# EAGLE schematic PWM_Board_77X (EAGLE 7.7.0)

## Sheet 1 of 7
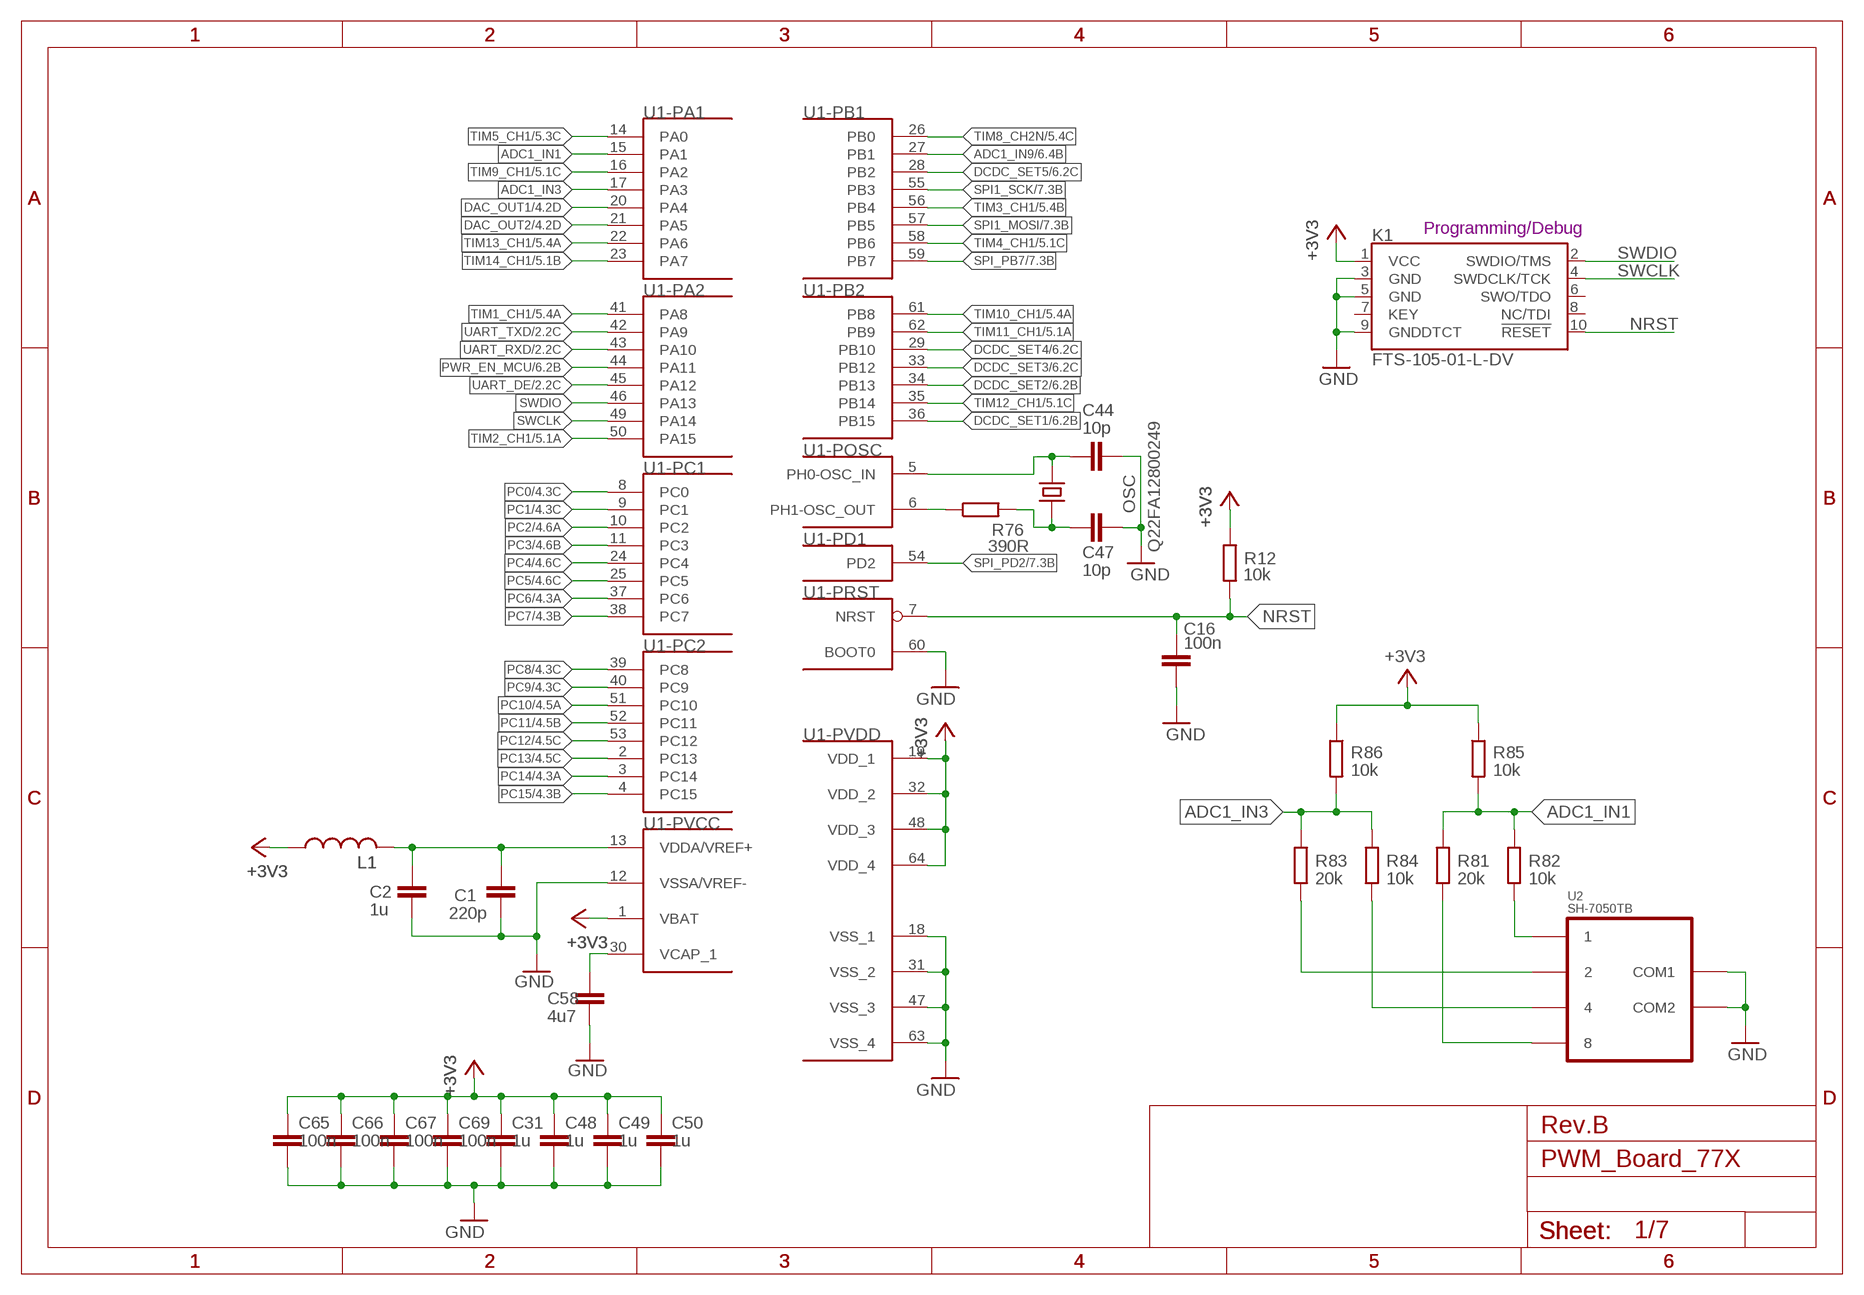
[diagram p0: schematic, sheet 1]

### Parts
C1  220p  C-EUC0603  [C0603]
C2  1u  C-EUC0805  [C0805]
C16  100n  C-EUC0603  [C0603]
C31  1u  C-EUC0805  [C0805]
C44  10p  C-EUC0603  [C0603]
C47  10p  C-EUC0603  [C0603]
C48  1u  C-EUC0805  [C0805]
C49  1u  C-EUC0805  [C0805]
C50  1u  C-EUC0805  [C0805]
C58  4u7  C-EUC0805  [C0805]
C65  100n  C-EUC0805  [C0805]
C66  100n  C-EUC0805  [C0805]
C67  100n  C-EUC0805  [C0805]
C69  100n  C-EUC0805  [C0805]
K1  FTS-105-01-L-DV  CORTEX_DEBUG_SMD  [SAMTECH_FTSH-105-01]
L1  L-US  [R1206]
OSC  Q22FA12800249  [OSCILATOR]
R12  10k  R-EU_R0603  [R0603]
R76  390R  R-EU_R0603  [R0603]
R81  20k  R-EU_R0603  [R0603]
R82  10k  R-EU_R0603  [R0603]
R83  20k  R-EU_R0603  [R0603]
R84  10k  R-EU_R0603  [R0603]
R85  10k  R-EU_R0603  [R0603]
R86  10k  R-EU_R0603  [R0603]
U1  STM32F446RE_64PIN  [LQFP64_F446RE]
U2  SH-7050TB  [HEX_DEC]

### Nets
+3V3: C31.1 C48.1 C49.1 C50.1 C65.1 C66.1 C67.1 C69.1 K1.1(VCC) L1.1 R12.2 R85.1 R86.1 U1.1(-PVCC:VBAT) U1.19(-PVDD:VDD_1) U1.32(-PVDD:VDD_2) U1.48(-PVDD:VDD_3) U1.64(-PVDD:VDD_4) ; also sheet 2,3
ADC1_IN1: R81.1 R82.1 R85.2 U1.15(-PA1:PA1)
ADC1_IN3: R83.1 R84.1 R86.2 U1.17(-PA1:PA3)
ADC1_IN9: U1.27(-PB1:PB1) ; also sheet 6
DAC_OUT1: U1.20(-PA1:PA4) ; also sheet 4
DAC_OUT2: U1.21(-PA1:PA5) ; also sheet 4
DCDC_SET1: U1.36(-PB2:PB15) ; also sheet 6
DCDC_SET2: U1.34(-PB2:PB13) ; also sheet 6
DCDC_SET3: U1.33(-PB2:PB12) ; also sheet 6
DCDC_SET4: U1.29(-PB2:PB10) ; also sheet 6
DCDC_SET5: U1.28(-PB1:PB2) ; also sheet 6
GND: C1.2 C2.2 C16.2 C31.2 C44.1 C47.1 C48.2 C49.2 C50.2 C58.2 C65.2 C66.2 C67.2 C69.2 K1.3(GND) K1.5(GND) K1.9(GNDDTCT) U1.12(-PVCC:VSSA/VREF-) U1.18(-PVDD:VSS_1) U1.31(-PVDD:VSS_2) U1.47(-PVDD:VSS_3) U1.60(-PRST:BOOT0) U1.63(-PVDD:VSS_4) U2.C1(COM1) U2.C2(COM2) ; also sheet 2,3,4,5,6,7
N$44: R81.2 U2.8
N$48: R83.2 U2.2
N$70: C58.1 U1.30(-PVCC:VCAP_1)
N$85: R84.2 U2.4
N$116: R82.2 U2.1
NRST: C16.1 K1.10(!RESET) R12.1 U1.7(-PRST:NRST)
OSC: C47.2 OSC.3 R76.2
OSC_IN: C44.2 OSC.1 U1.5(-POSC:PH0-OSC_IN)
OSC_OUT: R76.1 U1.6(-POSC:PH1-OSC_OUT)
PC0: U1.8(-PC1:PC0) ; also sheet 4
PC1: U1.9(-PC1:PC1) ; also sheet 4
PC2: U1.10(-PC1:PC2) ; also sheet 4
PC3: U1.11(-PC1:PC3) ; also sheet 4
PC4: U1.24(-PC1:PC4) ; also sheet 4
PC5: U1.25(-PC1:PC5) ; also sheet 4
PC6: U1.37(-PC1:PC6) ; also sheet 4
PC7: U1.38(-PC1:PC7) ; also sheet 4
PC8: U1.39(-PC2:PC8) ; also sheet 4
PC9: U1.40(-PC2:PC9) ; also sheet 4
PC10: U1.51(-PC2:PC10) ; also sheet 4
PC11: U1.52(-PC2:PC11) ; also sheet 4
PC12: U1.53(-PC2:PC12) ; also sheet 4
PC13: U1.2(-PC2:PC13) ; also sheet 4
PC14: U1.3(-PC2:PC14) ; also sheet 4
PC15: U1.4(-PC2:PC15) ; also sheet 4
PWR_EN_MCU: U1.44(-PA2:PA11) ; also sheet 6
SPI1_MOSI: U1.57(-PB1:PB5) ; also sheet 7
SPI1_SCK: U1.55(-PB1:PB3) ; also sheet 7
SPI_PB7: U1.59(-PB1:PB7) ; also sheet 7
SPI_PD2: U1.54(-PD1:PD2) ; also sheet 7
SWCLK: K1.4(SWDCLK/TCK) U1.49(-PA2:PA14)
SWDIO: K1.2(SWDIO/TMS) U1.46(-PA2:PA13)
TIM1_CH1: U1.41(-PA2:PA8) ; also sheet 5
TIM2_CH1: U1.50(-PA2:PA15) ; also sheet 5
TIM3_CH1: U1.56(-PB1:PB4) ; also sheet 5
TIM4_CH1: U1.58(-PB1:PB6) ; also sheet 5
TIM5_CH1: U1.14(-PA1:PA0) ; also sheet 5
TIM8_CH2N: U1.26(-PB1:PB0) ; also sheet 5
TIM9_CH1: U1.16(-PA1:PA2) ; also sheet 5
TIM10_CH1: U1.61(-PB2:PB8) ; also sheet 5
TIM11_CH1: U1.62(-PB2:PB9) ; also sheet 5
TIM12_CH1: U1.35(-PB2:PB14) ; also sheet 5
TIM13_CH1: U1.22(-PA1:PA6) ; also sheet 5
TIM14_CH1: U1.23(-PA1:PA7) ; also sheet 5
UART_DE: U1.45(-PA2:PA12) ; also sheet 2
UART_RXD: U1.43(-PA2:PA10) ; also sheet 2
UART_TXD: U1.42(-PA2:PA9) ; also sheet 2
VREF+: C1.1 C2.1 L1.2 U1.13(-PVCC:VDDA/VREF+)
Unconnected: K1.6(SWO/TDO) K1.7(KEY) K1.8(NC/TDI)

### Notes on the sheet
- Programming/Debug
- Rev.B

## Sheet 2 of 7
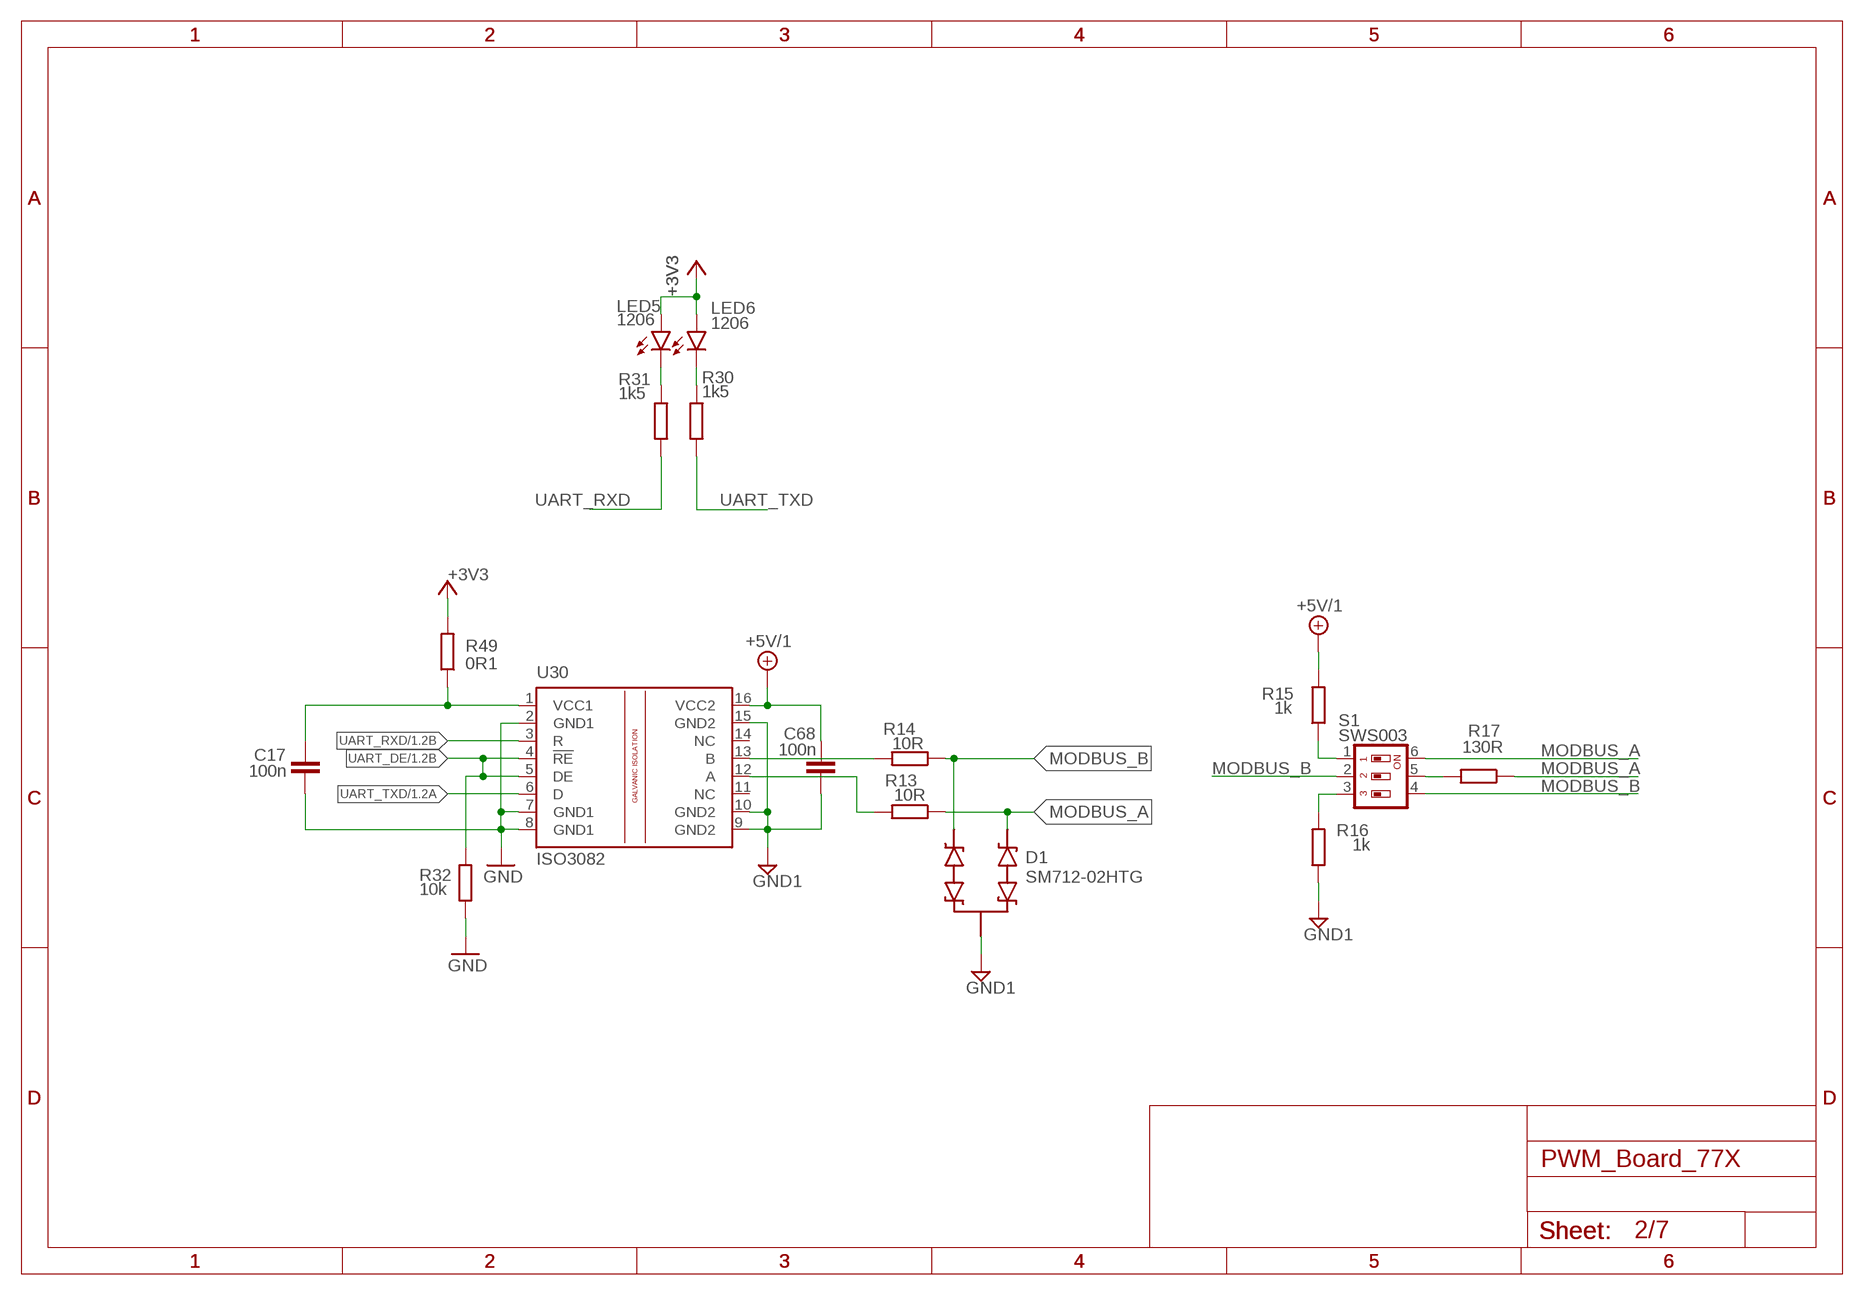
[diagram p1: schematic, sheet 2]

### Parts
C17  100n  C-EUC0805  [C0805]
C68  100n  C-EUC0805  [C0805]
D1  SM712-02HTG  [SOT23-BEC]
LED5  1206  LEDCHIPLED_1206  [CHIPLED_1206]
LED6  1206  LEDCHIPLED_1206  [CHIPLED_1206]
R13  10R  R-EU_R0603  [R0603]
R14  10R  R-EU_R0603  [R0603]
R15  1k  R-EU_R0603  [R0603]
R16  1k  R-EU_R0603  [R0603]
R17  130R  R-EU_R1206  [R1206]
R30  1k5  R-EU_R1206  [R1206]
R31  1k5  R-EU_R1206  [R1206]
R32  10k  R-EU_R0603  [R0603]
R49  0R1  R-EU_R1206  [R1206]
S1  SWS003  [SMS-003]
U30  ISO3082  [SO-16DW]

### Nets
+3V3: LED5.A LED6.A R49.2 ; also sheet 1,3
+5V/1: C68.1 R15.2 U30.16(VCC2) ; also sheet 3
GND: C17.2 R32.1 U30.2(GND1) U30.7(GND1) U30.8(GND1) ; also sheet 1,3,4,5,6,7
GND1: C68.2 D1.C(E) R16.1 U30.9(GND2) U30.10(GND2) U30.15(GND2) ; also sheet 3
MODBUS_A: D1.E R13.1 R17.1 S1.6 ; also sheet 3
MODBUS_B: D1.B R14.1 S1.2 S1.4 ; also sheet 3
N$7: R14.2 U30.13(B)
N$20: LED5.C R31.1
N$23: R13.2 U30.12(A)
N$34: R15.1 S1.1
N$35: R16.2 S1.3
N$36: R17.2 S1.5
N$37: LED6.C R30.1
N$67: C17.1 R49.1 U30.1(VCC1)
UART_DE: R32.2 U30.4(!RE) U30.5(DE) ; also sheet 1
UART_RXD: R31.2 U30.3(R) ; also sheet 1
UART_TXD: R30.2 U30.6(D) ; also sheet 1
Unconnected: U30.11(NC) U30.14(NC)

## Sheet 3 of 7
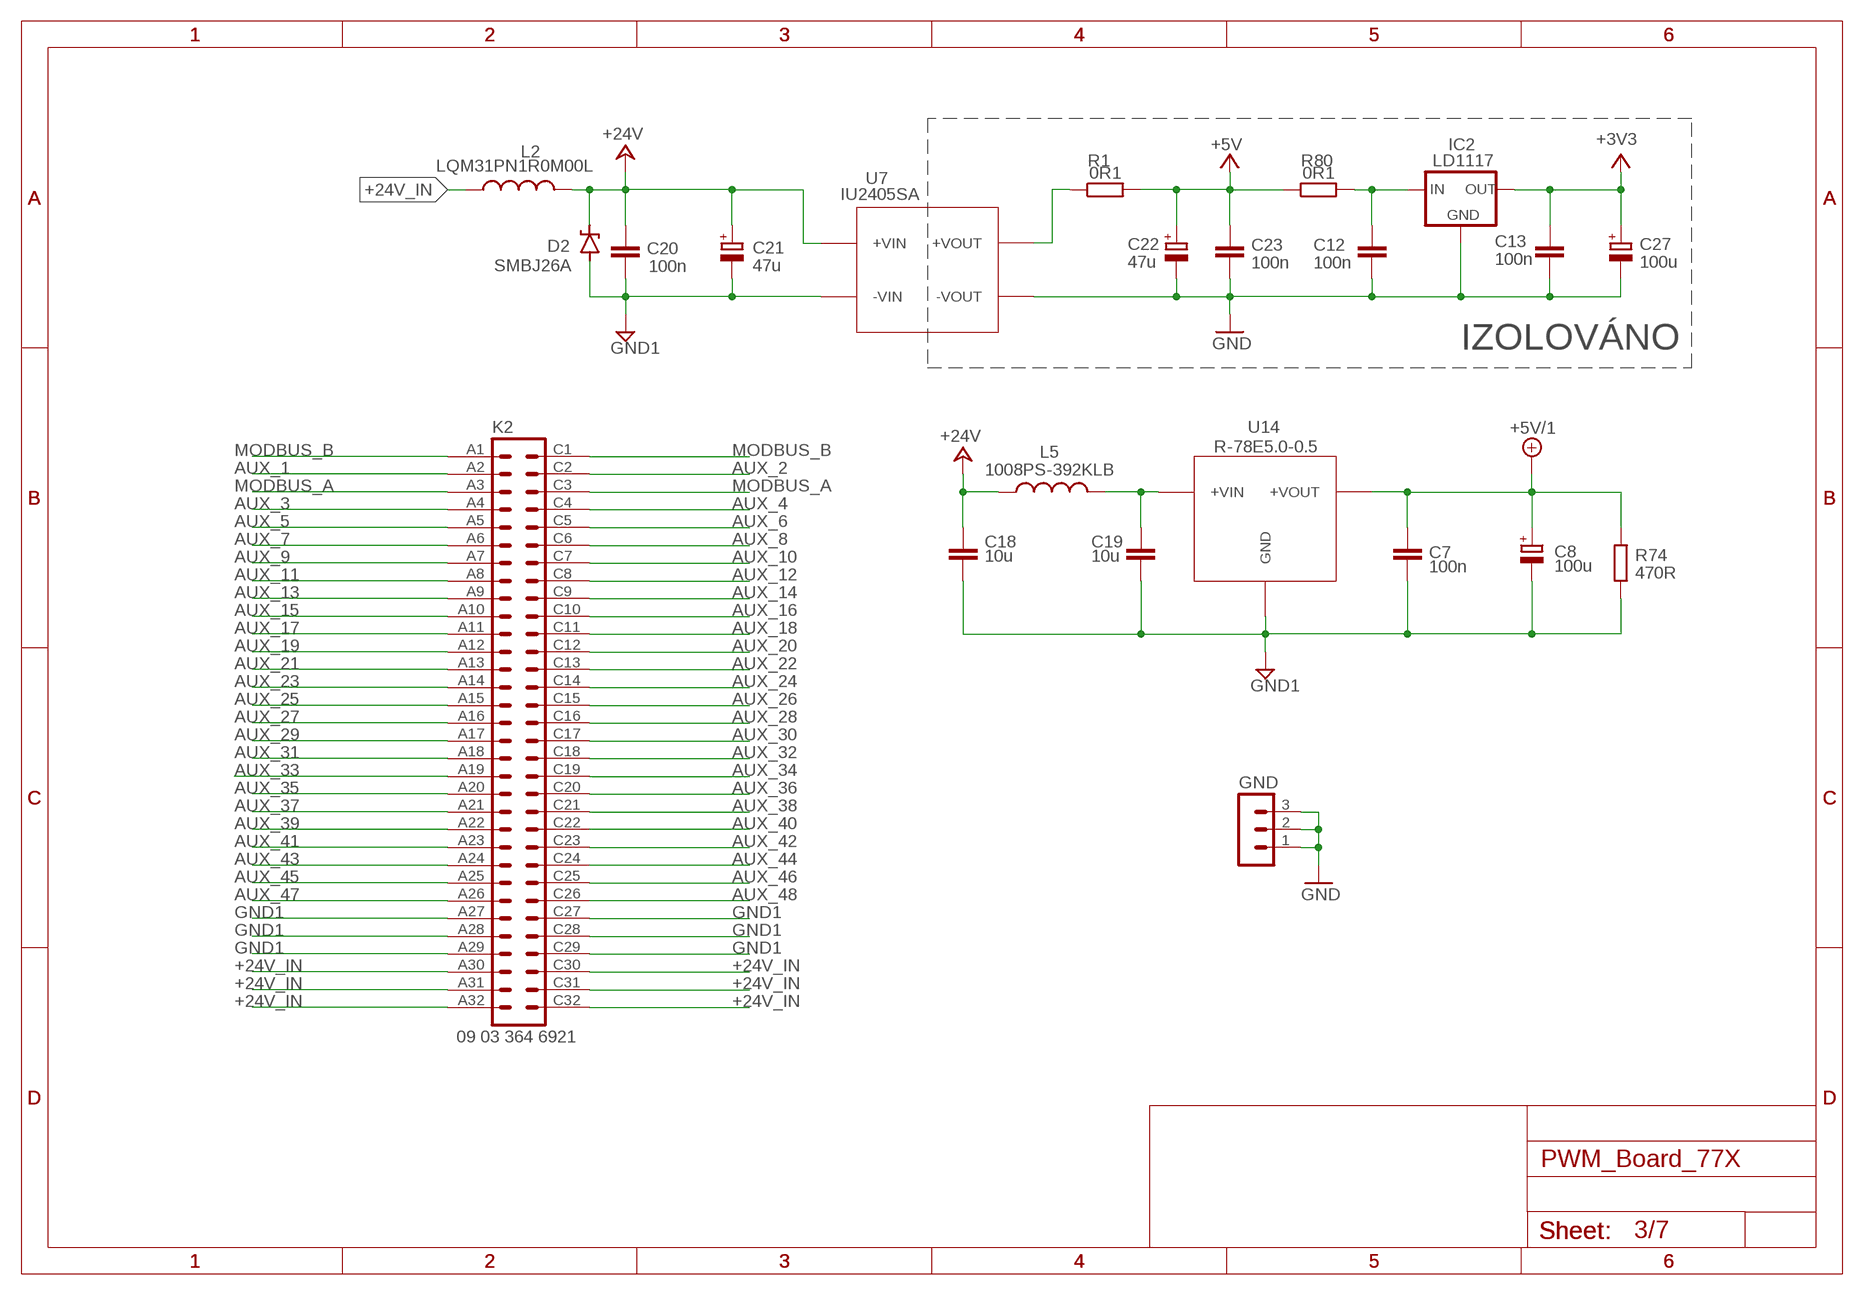
[diagram p2: schematic, sheet 3]

### Parts
C7  100n  C-EUC0805  [C0805]
C8  100u  CPOL-EU153CLV-0605  [153CLV-0605]
C12  100n  C-EUC0805  [C0805]
C13  100n  C-EUC0805  [C0805]
C18  10u  C-EUC1206  [C1206]
C19  10u  C-EUC1206  [C1206]
C20  100n  C-EUC1206  [C1206]
C21  47u  CPOL-EUE3.5-8  [E3,5-8]
C22  47u  CPOL-EU150CLZ-1014  [150CLZ-1014]
C23  100n  C-EUC0805  [C0805]
C27  100u  CPOL-EU153CLV-0605  [153CLV-0605]
D2  SMBJ26A  [SMB]
GND  MA03-1  [MA03-1]
IC2  LD1117  LM1117  [SOT223]
K2  09 03 364 6921  VG64P  [VG64P]
L2  LQM31PN1R0M00L  L-US  [R1206]
L5  1008PS-392KLB  L-USL1812:1  [L1812]
R1  0R1  R-EU_R1206  [R1206]
R74  470R  R-EU_R1206  [R1206]
R80  0R1  R-EU_R1206  [R1206]
U7  IU2405SA  [IU2405SA]
U14  R-78C5.0-0.5  R-78E-0.5  [R-78E-0.5]

### Nets
+3V3: C13.1 C27.+ IC2.2(OUT) ; also sheet 1,2
+5V: C22.+ C23.1 R1.2 R80.1 ; also sheet 4,5,6,7
+5V/1: C7.1 C8.+ R74.2 U14.3(+VOUT) ; also sheet 2
+24V: C18.1 C20.1 C21.+ D2.C L2.2 L5.1 U7.VIN+(+VIN)
+24V_IN: K2.A30 K2.A31 K2.A32 K2.C30 K2.C31 K2.C32 L2.1
AUX_1: K2.A2
AUX_2: K2.C2
AUX_3: K2.A4
AUX_4: K2.C4
AUX_5: K2.A5
AUX_6: K2.C5
AUX_7: K2.A6
AUX_8: K2.C6
AUX_9: K2.A7
AUX_10: K2.C7
AUX_11: K2.A8
AUX_12: K2.C8
AUX_13: K2.A9
AUX_14: K2.C9
AUX_15: K2.A10
AUX_16: K2.C10
AUX_17: K2.A11
AUX_18: K2.C11
AUX_19: K2.A12
AUX_20: K2.C12
AUX_21: K2.A13
AUX_22: K2.C13
AUX_23: K2.A14
AUX_24: K2.C14
AUX_25: K2.A15
AUX_26: K2.C15
AUX_27: K2.A16
AUX_28: K2.C16
AUX_29: K2.A17
AUX_30: K2.C17
AUX_31: K2.A18
AUX_32: K2.C18
AUX_33: K2.A19
AUX_34: K2.C19
AUX_35: K2.A20
AUX_36: K2.C20
AUX_37: K2.A21
AUX_38: K2.C21
AUX_39: K2.A22
AUX_40: K2.C22
AUX_41: K2.A23
AUX_42: K2.C23
AUX_43: K2.A24
AUX_44: K2.C24
AUX_45: K2.A25
AUX_46: K2.C25
AUX_47: K2.A26
AUX_48: K2.C26
GND: C12.2 C13.2 C22.- C23.2 C27.- GND.1 GND.2 GND.3 IC2.1(GND) U7.VOUT-(-VOUT) ; also sheet 1,2,4,5,6,7
GND1: C7.2 C8.- C18.2 C19.2 C20.2 C21.- D2.A K2.A27 K2.A28 K2.A29 K2.C27 K2.C28 K2.C29 R74.1 U7.VIN-(-VIN) U14.2(GND) ; also sheet 2
MODBUS_A: K2.A3 K2.C3 ; also sheet 2
MODBUS_B: K2.A1 K2.C1 ; also sheet 2
N$19: R1.1 U7.VOUT+(+VOUT)
N$30: C12.1 IC2.3(IN) R80.2
N$32: C19.1 L5.2 U14.1(+VIN)

### Notes on the sheet
- IU2405SA
- IZOLOVÁNO
- R-78E5.0-0.5

## Sheet 4 of 7
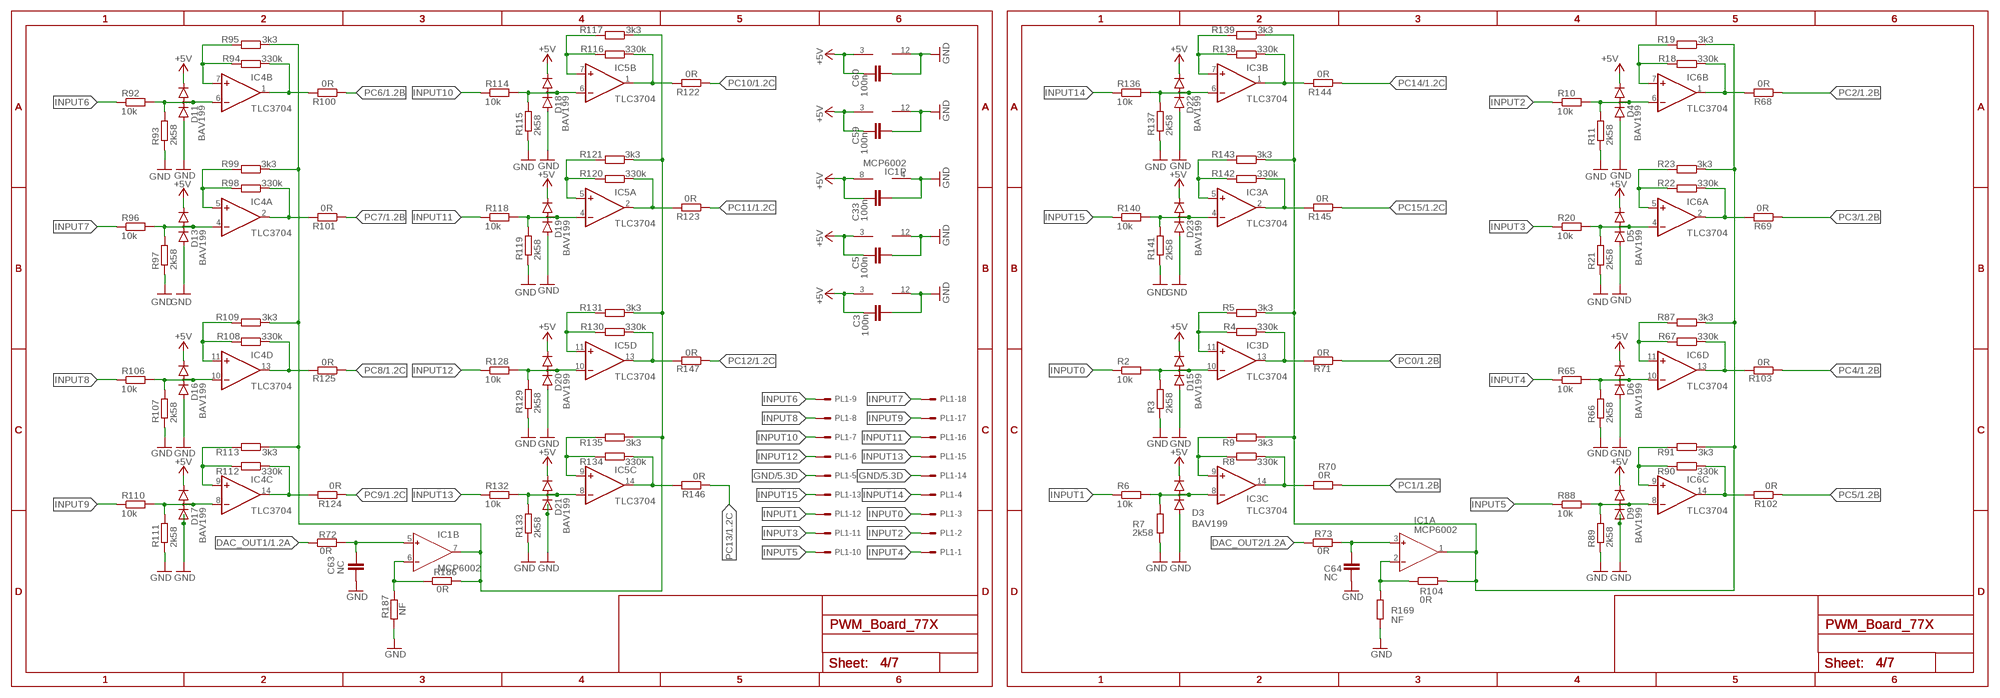
[diagram p3: schematic, sheet 4]

### Parts
C3  100n  C-EUC0805  [C0805]
C5  100n  C-EUC0805  [C0805]
C33  100n  C-EUC0805  [C0805]
C59  100n  C-EUC0805  [C0805]
C60  100n  C-EUC0805  [C0805]
C63  NC  C-EUC0603  [C0603]
C64  NC  C-EUC0603  [C0603]
D3  BAV199  [SOT23]
D4  BAV199  [SOT23]
D5  BAV199  [SOT23]
D6  BAV199  [SOT23]
D9  BAV199  [SOT23]
D11  BAV199  [SOT23]
D13  BAV199  [SOT23]
D15  BAV199  [SOT23]
D16  BAV199  [SOT23]
D17  BAV199  [SOT23]
D18  BAV199  [SOT23]
D19  BAV199  [SOT23]
D20  BAV199  [SOT23]
D21  BAV199  [SOT23]
D22  BAV199  [SOT23]
D23  BAV199  [SOT23]
IC1  MCP6002  AD8599R  [SO8]
IC3  TLC3704  TLC339D  [SO14]
IC4  TLC3704  TLC339D  [SO14]
IC5  TLC3704  TLC339D  [SO14]
IC6  TLC3704  TLC339D  [SO14]
PL1  555X-18H-NO-HOLES  [5569-18_NO_HOLES]
R2  10k  R-EU_R1206  [R1206]
R3  2k58  R-EU_R0603  [R0603]
R4  330k  R-EU_R0603  [R0603]
R5  3k3  R-EU_R0603  [R0603]
R6  10k  R-EU_R1206  [R1206]
R7  2k58  R-EU_R0603  [R0603]
R8  330k  R-EU_R0603  [R0603]
R9  3k3  R-EU_R0603  [R0603]
R10  10k  R-EU_R1206  [R1206]
R11  2k58  R-EU_R0603  [R0603]
R18  330k  R-EU_R0603  [R0603]
R19  3k3  R-EU_R0603  [R0603]
R20  10k  R-EU_R1206  [R1206]
R21  2k58  R-EU_R0603  [R0603]
R22  330k  R-EU_R0603  [R0603]
R23  3k3  R-EU_R0603  [R0603]
R65  10k  R-EU_R1206  [R1206]
R66  2k58  R-EU_R0603  [R0603]
R67  330k  R-EU_R0603  [R0603]
R68  0R  R-EU_R0603  [R0603]
R69  0R  R-EU_R0603  [R0603]
R70  0R  R-EU_R0603  [R0603]
R71  0R  R-EU_R0603  [R0603]
R72  0R  R-EU_R0603  [R0603]
R73  0R  R-EU_R0603  [R0603]
R87  3k3  R-EU_R0603  [R0603]
R88  10k  R-EU_R1206  [R1206]
R89  2k58  R-EU_R0603  [R0603]
R90  330k  R-EU_R0603  [R0603]
R91  3k3  R-EU_R0603  [R0603]
R92  10k  R-EU_R1206  [R1206]
R93  2k58  R-EU_R0603  [R0603]
R94  330k  R-EU_R0603  [R0603]
R95  3k3  R-EU_R0603  [R0603]
R96  10k  R-EU_R1206  [R1206]
R97  2k58  R-EU_R0603  [R0603]
R98  330k  R-EU_R0603  [R0603]
R99  3k3  R-EU_R0603  [R0603]
R100  0R  R-EU_R0603  [R0603]
R101  0R  R-EU_R0603  [R0603]
R102  0R  R-EU_R0603  [R0603]
R103  0R  R-EU_R0603  [R0603]
R104  0R  R-EU_R0603  [R0603]
R106  10k  R-EU_R1206  [R1206]
R107  2k58  R-EU_R0603  [R0603]
R108  330k  R-EU_R0603  [R0603]
R109  3k3  R-EU_R0603  [R0603]
R110  10k  R-EU_R1206  [R1206]
R111  2k58  R-EU_R0603  [R0603]
R112  330k  R-EU_R0603  [R0603]
R113  3k3  R-EU_R0603  [R0603]
R114  10k  R-EU_R1206  [R1206]
R115  2k58  R-EU_R0603  [R0603]
R116  330k  R-EU_R0603  [R0603]
R117  3k3  R-EU_R0603  [R0603]
R118  10k  R-EU_R1206  [R1206]
R119  2k58  R-EU_R0603  [R0603]
R120  330k  R-EU_R0603  [R0603]
R121  3k3  R-EU_R0603  [R0603]
R122  0R  R-EU_R0603  [R0603]
R123  0R  R-EU_R0603  [R0603]
R124  0R  R-EU_R0603  [R0603]
R125  0R  R-EU_R0603  [R0603]
R128  10k  R-EU_R1206  [R1206]
R129  2k58  R-EU_R0603  [R0603]
R130  330k  R-EU_R0603  [R0603]
R131  3k3  R-EU_R0603  [R0603]
R132  10k  R-EU_R1206  [R1206]
R133  2k58  R-EU_R0603  [R0603]
R134  330k  R-EU_R0603  [R0603]
R135  3k3  R-EU_R0603  [R0603]
R136  10k  R-EU_R1206  [R1206]
R137  2k58  R-EU_R0603  [R0603]
R138  330k  R-EU_R0603  [R0603]
R139  3k3  R-EU_R0603  [R0603]
R140  10k  R-EU_R1206  [R1206]
R141  2k58  R-EU_R0603  [R0603]
R142  330k  R-EU_R0603  [R0603]
R143  3k3  R-EU_R0603  [R0603]
R144  0R  R-EU_R0603  [R0603]
R145  0R  R-EU_R0603  [R0603]
R146  0R  R-EU_R0603  [R0603]
R147  0R  R-EU_R0603  [R0603]
R169  NF  R-EU_R0603  [R0603]
R186  0R  R-EU_R0603  [R0603]
R187  NF  R-EU_R0603  [R0603]

### Nets
+5V: C3.1 C5.1 C33.1 C59.1 C60.1 D3.2(C) D4.2(C) D5.2(C) D6.2(C) D9.2(C) D11.2(C) D13.2(C) D15.2(C) D16.2(C) D17.2(C) D18.2(C) D19.2(C) D20.2(C) D21.2(C) D22.2(C) D23.2(C) IC1.8(P:V+) IC3.3(P:V+) IC4.3(P:V+) IC5.3(P:V+) IC6.3(P:V+) ; also sheet 3,5,6,7
DAC_OUT1: R72.1 ; also sheet 1
DAC_OUT2: R73.1 ; also sheet 1
GND: C3.2 C5.2 C33.2 C59.2 C60.2 C63.2 C64.2 D3.1(A) D4.1(A) D5.1(A) D6.1(A) D9.1(A) D11.1(A) D13.1(A) D15.1(A) D16.1(A) D17.1(A) D18.1(A) D19.1(A) D20.1(A) D21.1(A) D22.1(A) D23.1(A) IC1.4(P:V-) IC3.12(P:V-) IC4.12(P:V-) IC5.12(P:V-) IC6.12(P:V-) PL1.5 PL1.14 R3.1 R7.1 R11.1 R21.1 R66.1 R89.1 R93.1 R97.1 R107.1 R111.1 R115.1 R119.1 R129.1 R133.1 R137.1 R141.1 R169.1 R187.1 ; also sheet 1,2,3,5,6,7
INPUT0: PL1.3 R2.1
INPUT1: PL1.12 R6.1
INPUT2: PL1.2 R10.1
INPUT3: PL1.11 R20.1
INPUT4: PL1.1 R65.1
INPUT5: PL1.10 R88.1
INPUT6: PL1.9 R92.1
INPUT7: PL1.18 R96.1
INPUT8: PL1.8 R106.1
INPUT9: PL1.17 R110.1
INPUT10: PL1.7 R114.1
INPUT11: PL1.16 R118.1
INPUT12: PL1.6 R128.1
INPUT13: PL1.15 R132.1
INPUT14: PL1.4 R136.1
INPUT15: PL1.13 R140.1
N$1: IC3.11(D:+IN) R4.2 R5.2
N$2: D3.3(AC) IC3.8(C:-IN) R6.2 R7.2
N$3: D15.3(AC) IC3.10(D:-IN) R2.2 R3.2
N$4: IC3.9(C:+IN) R8.2 R9.2
N$5: D4.3(AC) IC6.6(B:-IN) R10.2 R11.2
N$6: IC6.7(B:+IN) R18.2 R19.2
N$8: D5.3(AC) IC6.4(A:-IN) R20.2 R21.2
N$9: IC6.5(A:+IN) R22.2 R23.2
N$16: IC1.6(B:IN-) R186.1 R187.2
N$21: C63.1 IC1.5(B:IN+) R72.2
N$24: IC6.1(B:OUT) R18.1 R68.2
N$25: C64.1 IC1.3(A:IN+) R73.2
N$29: IC6.2(A:OUT) R22.1 R69.2
N$38: IC1.2(A:IN-) R104.1 R169.2
N$52: IC1.7(B:OUT) R95.1 R99.1 R109.1 R113.1 R117.1 R121.1 R131.1 R135.1 R186.2
N$57: IC3.14(C:OUT) R8.1 R70.2
N$58: IC3.13(D:OUT) R4.1 R71.2
N$59: IC1.1(A:OUT) R5.1 R9.1 R19.1 R23.1 R87.1 R91.1 R104.2 R139.1 R143.1
N$62: D6.3(AC) IC6.10(D:-IN) R65.2 R66.2
N$64: D9.3(AC) IC6.8(C:-IN) R88.2 R89.2
N$72: IC6.9(C:+IN) R90.2 R91.2
N$73: D11.3(AC) IC4.6(B:-IN) R92.2 R93.2
N$74: IC4.7(B:+IN) R94.2 R95.2
N$75: D13.3(AC) IC4.4(A:-IN) R96.2 R97.2
N$76: IC4.5(A:+IN) R98.2 R99.2
N$77: IC6.11(D:+IN) R67.2 R87.2
N$78: IC4.1(B:OUT) R94.1 R100.2
N$79: IC4.2(A:OUT) R98.1 R101.2
N$80: IC6.14(C:OUT) R90.1 R102.2
N$81: IC6.13(D:OUT) R67.1 R103.2
N$86: D16.3(AC) IC4.10(D:-IN) R106.2 R107.2
N$87: D17.3(AC) IC4.8(C:-IN) R110.2 R111.2
N$88: IC4.9(C:+IN) R112.2 R113.2
N$89: D18.3(AC) IC5.6(B:-IN) R114.2 R115.2
N$90: IC5.7(B:+IN) R116.2 R117.2
N$91: D19.3(AC) IC5.4(A:-IN) R118.2 R119.2
N$92: IC5.5(A:+IN) R120.2 R121.2
N$93: IC4.11(D:+IN) R108.2 R109.2
N$94: IC5.1(B:OUT) R116.1 R122.2
N$95: IC5.2(A:OUT) R120.1 R123.2
N$96: IC4.14(C:OUT) R112.1 R124.2
N$97: IC4.13(D:OUT) R108.1 R125.2
N$102: D20.3(AC) IC5.10(D:-IN) R128.2 R129.2
N$103: D21.3(AC) IC5.8(C:-IN) R132.2 R133.2
N$104: IC5.9(C:+IN) R134.2 R135.2
N$105: D22.3(AC) IC3.6(B:-IN) R136.2 R137.2
N$106: IC3.7(B:+IN) R138.2 R139.2
N$107: D23.3(AC) IC3.4(A:-IN) R140.2 R141.2
N$108: IC3.5(A:+IN) R142.2 R143.2
N$109: IC5.11(D:+IN) R130.2 R131.2
N$110: IC3.1(B:OUT) R138.1 R144.2
N$111: IC3.2(A:OUT) R142.1 R145.2
N$112: IC5.14(C:OUT) R134.1 R146.2
N$113: IC5.13(D:OUT) R130.1 R147.2
PC0: R71.1 ; also sheet 1
PC1: R70.1 ; also sheet 1
PC2: R68.1 ; also sheet 1
PC3: R69.1 ; also sheet 1
PC4: R103.1 ; also sheet 1
PC5: R102.1 ; also sheet 1
PC6: R100.1 ; also sheet 1
PC7: R101.1 ; also sheet 1
PC8: R125.1 ; also sheet 1
PC9: R124.1 ; also sheet 1
PC10: R122.1 ; also sheet 1
PC11: R123.1 ; also sheet 1
PC12: R147.1 ; also sheet 1
PC13: R146.1 ; also sheet 1
PC14: R144.1 ; also sheet 1
PC15: R145.1 ; also sheet 1

## Sheet 5 of 7
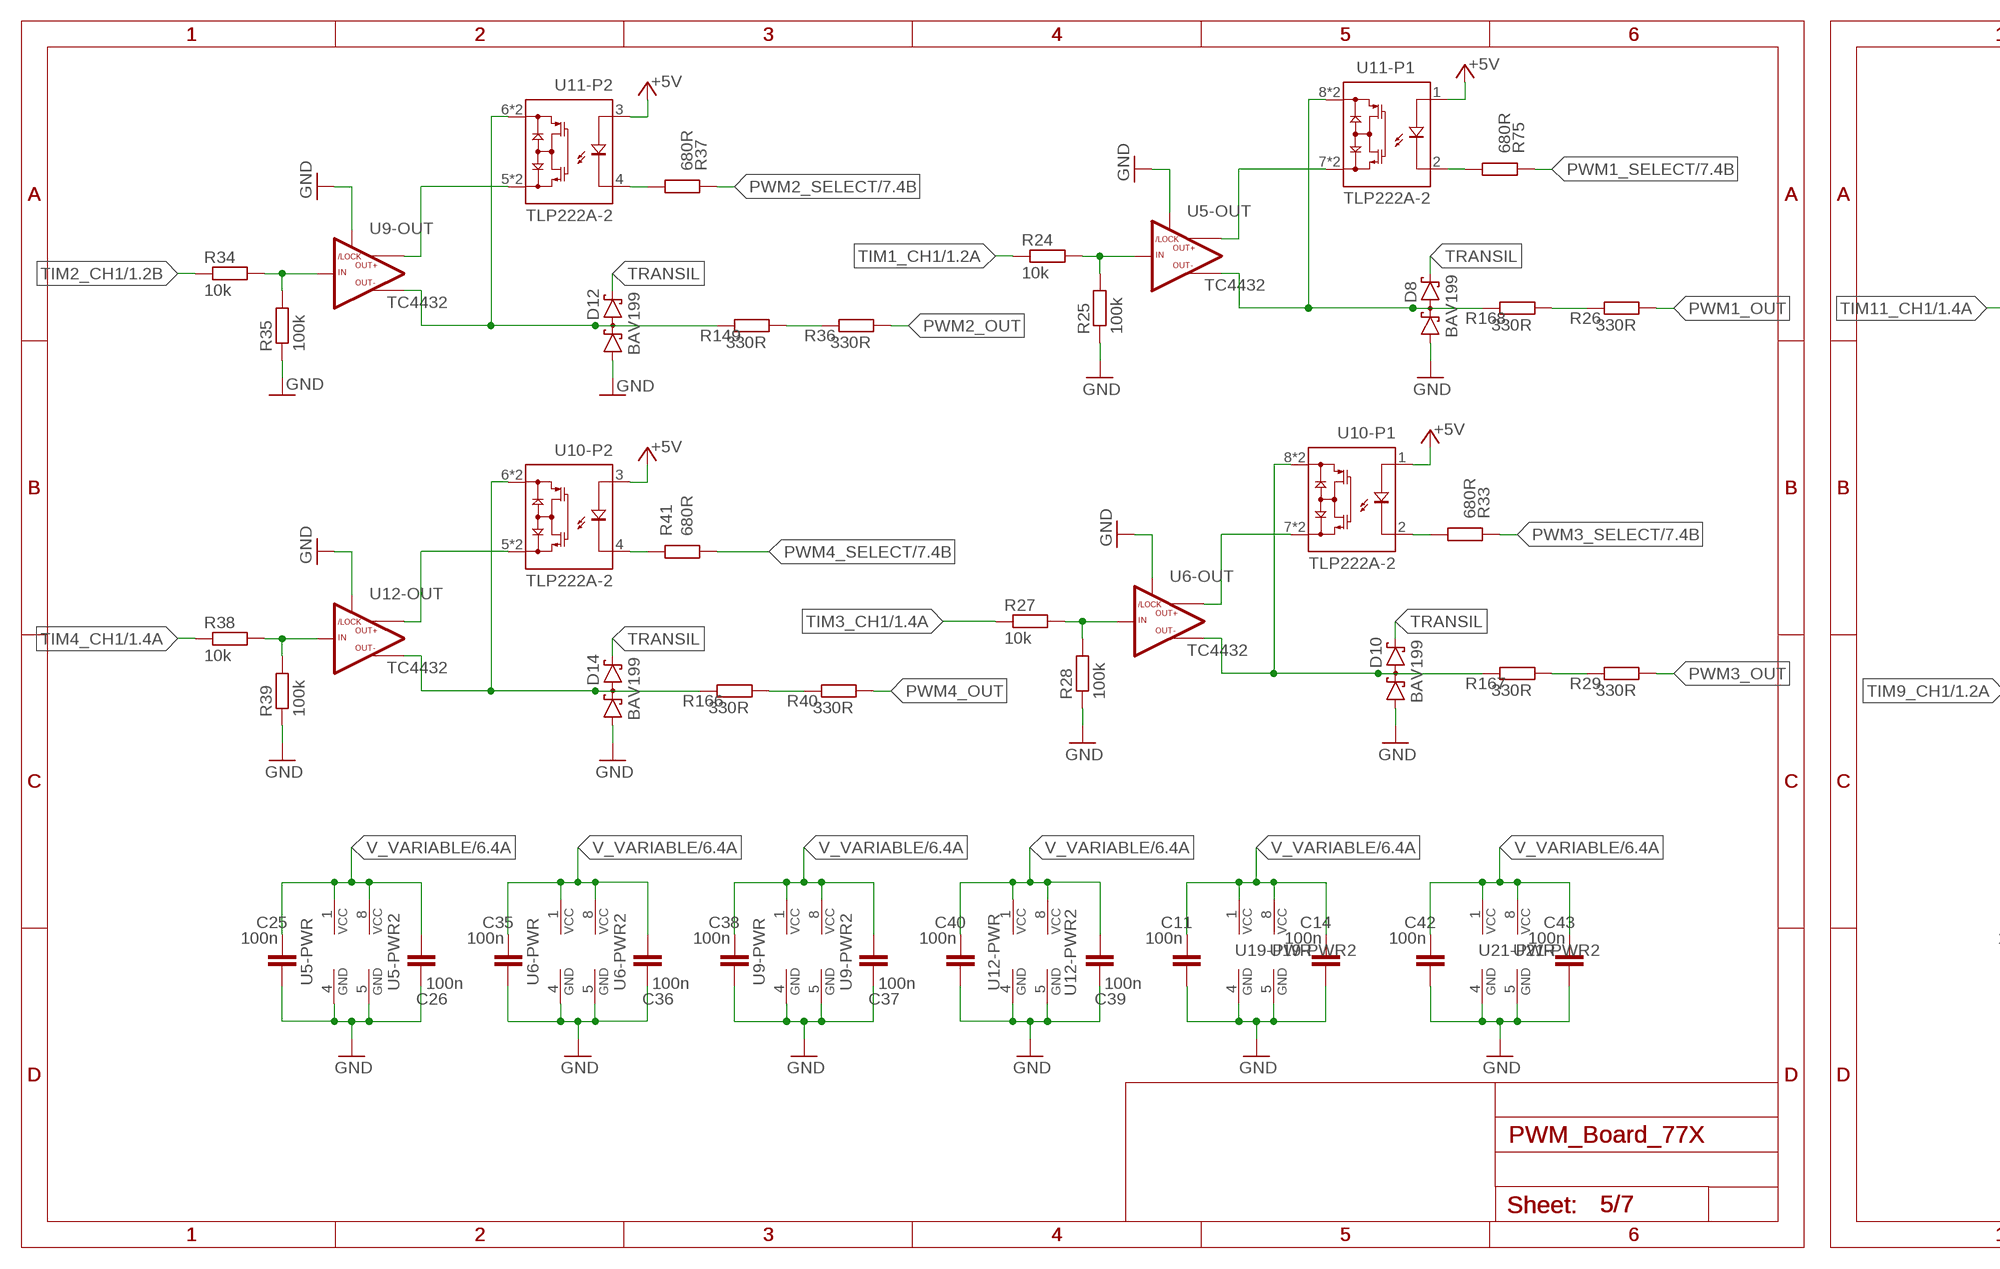
[diagram p4: schematic, sheet 5, part 1 of 2]
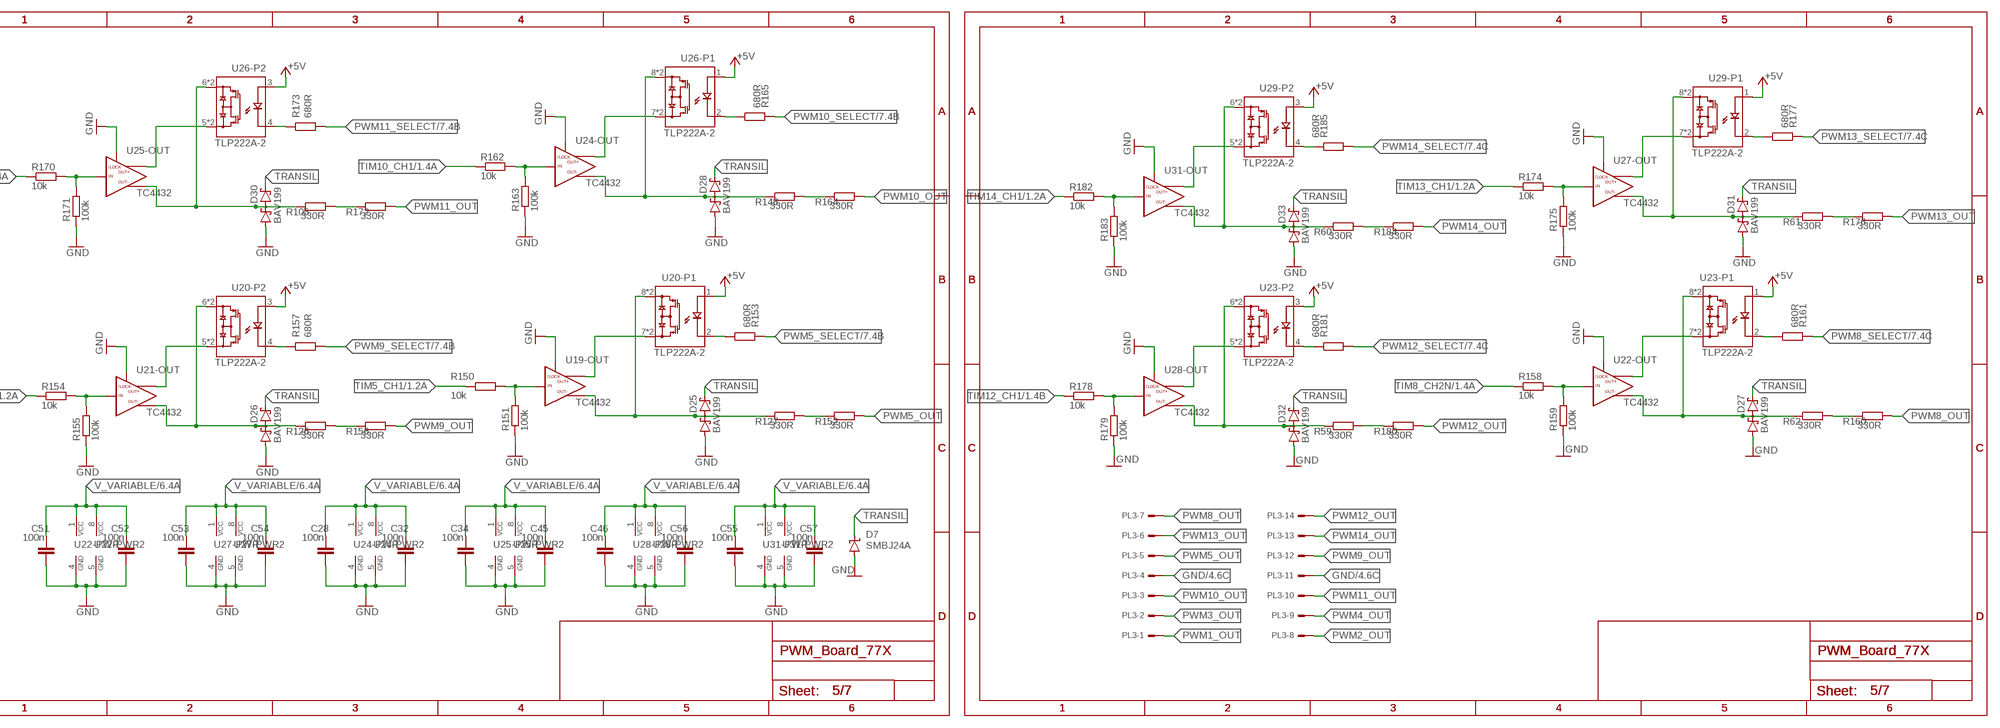
[diagram p5: schematic, sheet 5, part 2 of 2]

### Parts
C11  100n  C-EUC0805  [C0805]
C14  100n  C-EUC0805  [C0805]
C25  100n  C-EUC0805  [C0805]
C26  100n  C-EUC0805  [C0805]
C28  100n  C-EUC0805  [C0805]
C32  100n  C-EUC0805  [C0805]
C34  100n  C-EUC0805  [C0805]
C35  100n  C-EUC0805  [C0805]
C36  100n  C-EUC0805  [C0805]
C37  100n  C-EUC0805  [C0805]
C38  100n  C-EUC0805  [C0805]
C39  100n  C-EUC0805  [C0805]
C40  100n  C-EUC0805  [C0805]
C42  100n  C-EUC0805  [C0805]
C43  100n  C-EUC0805  [C0805]
C45  100n  C-EUC0805  [C0805]
C46  100n  C-EUC0805  [C0805]
C51  100n  C-EUC0805  [C0805]
C52  100n  C-EUC0805  [C0805]
C53  100n  C-EUC0805  [C0805]
C54  100n  C-EUC0805  [C0805]
C55  100n  C-EUC0805  [C0805]
C56  100n  C-EUC0805  [C0805]
C57  100n  C-EUC0805  [C0805]
D7  SMBJ24A  SUPPRESSOR-SMBJ  [SMBJ]
D8  BAV199  BAS70-04  [SOT23]
D10  BAV199  BAS70-04  [SOT23]
D12  BAV199  BAS70-04  [SOT23]
D14  BAV199  BAS70-04  [SOT23]
D25  BAV199  BAS70-04  [SOT23]
D26  BAV199  BAS70-04  [SOT23]
D27  BAV199  BAS70-04  [SOT23]
D28  BAV199  BAS70-04  [SOT23]
D30  BAV199  BAS70-04  [SOT23]
D31  BAV199  BAS70-04  [SOT23]
D32  BAV199  BAS70-04  [SOT23]
D33  BAV199  BAS70-04  [SOT23]
PL3  555X-14H-NO-HOLES  [5569-14_NO_HOLES]
R24  10k  R-EU_R0603  [R0603]
R25  100k  R-EU_R0603  [R0603]
R26  330R  R-EU_R1210  [R1210]
R27  10k  R-EU_R0603  [R0603]
R28  100k  R-EU_R0603  [R0603]
R29  330R  R-EU_R1210  [R1210]
R33  680R  R-EU_R0603  [R0603]
R34  10k  R-EU_R0603  [R0603]
R35  100k  R-EU_R0603  [R0603]
R36  330R  R-EU_R1210  [R1210]
R37  680R  R-EU_R0603  [R0603]
R38  10k  R-EU_R0603  [R0603]
R39  100k  R-EU_R0603  [R0603]
R40  330R  R-EU_R1210  [R1210]
R41  680R  R-EU_R0603  [R0603]
R59  330R  R-EU_R1210  [R1210]
R60  330R  R-EU_R1210  [R1210]
R61  330R  R-EU_R1210  [R1210]
R62  330R  R-EU_R1210  [R1210]
R75  680R  R-EU_R0603  [R0603]
R105  330R  R-EU_R1210  [R1210]
R126  330R  R-EU_R1210  [R1210]
R127  330R  R-EU_R1210  [R1210]
R148  330R  R-EU_R1210  [R1210]
R149  330R  R-EU_R1210  [R1210]
R150  10k  R-EU_R0603  [R0603]
R151  100k  R-EU_R0603  [R0603]
R152  330R  R-EU_R1210  [R1210]
R153  680R  R-EU_R0603  [R0603]
R154  10k  R-EU_R0603  [R0603]
R155  100k  R-EU_R0603  [R0603]
R156  330R  R-EU_R1210  [R1210]
R157  680R  R-EU_R0603  [R0603]
R158  10k  R-EU_R0603  [R0603]
R159  100k  R-EU_R0603  [R0603]
R160  330R  R-EU_R1210  [R1210]
R161  680R  R-EU_R0603  [R0603]
R162  10k  R-EU_R0603  [R0603]
R163  100k  R-EU_R0603  [R0603]
R164  330R  R-EU_R1210  [R1210]
R165  680R  R-EU_R0603  [R0603]
R166  330R  R-EU_R1210  [R1210]
R167  330R  R-EU_R1210  [R1210]
R168  330R  R-EU_R1210  [R1210]
R170  10k  R-EU_R0603  [R0603]
R171  100k  R-EU_R0603  [R0603]
R172  330R  R-EU_R1210  [R1210]
R173  680R  R-EU_R0603  [R0603]
R174  10k  R-EU_R0603  [R0603]
R175  100k  R-EU_R0603  [R0603]
R176  330R  R-EU_R1210  [R1210]
R177  680R  R-EU_R0603  [R0603]
R178  10k  R-EU_R0603  [R0603]
R179  100k  R-EU_R0603  [R0603]
R180  330R  R-EU_R1210  [R1210]
R181  680R  R-EU_R0603  [R0603]
R182  10k  R-EU_R0603  [R0603]
R183  100k  R-EU_R0603  [R0603]
R184  330R  R-EU_R1210  [R1210]
R185  680R  R-EU_R0603  [R0603]
U5  TC4432  [SO08]
U6  TC4432  [SO08]
U9  TC4432  [SO08]
U10  TLP222A-2  TLP222A-2/TLP171D  [DIL8-SMD_V2]
U11  TLP222A-2  TLP222A-2/TLP171D  [DIL8-SMD_V2]
U12  TC4432  [SO08]
U19  TC4432  [SO08]
U20  TLP222A-2  TLP222A-2/TLP171D  [DIL8-SMD_V2]
U21  TC4432  [SO08]
U22  TC4432  [SO08]
U23  TLP222A-2  TLP222A-2/TLP171D  [DIL8-SMD_V2]
U24  TC4432  [SO08]
U25  TC4432  [SO08]
U26  TLP222A-2  TLP222A-2/TLP171D  [DIL8-SMD_V2]
U27  TC4432  [SO08]
U28  TC4432  [SO08]
U29  TLP222A-2  TLP222A-2/TLP171D  [DIL8-SMD_V2]
U31  TC4432  [SO08]

### Nets
+5V: U10.1(-P1:A) U10.3(-P2:A) U11.1(-P1:A) U11.3(-P2:A) U20.1(-P1:A) U20.3(-P2:A) U23.1(-P1:A) U23.3(-P2:A) U26.1(-P1:A) U26.3(-P2:A) U29.1(-P1:A) U29.3(-P2:A) ; also sheet 3,4,6,7
GND: C11.2 C14.2 C25.2 C26.1 C28.2 C32.2 C34.2 C35.2 C36.1 C37.1 C38.2 C39.1 C40.2 C42.2 C43.2 C45.2 C46.2 C51.2 C52.2 C53.2 C54.2 C55.2 C56.2 C57.2 D7.A D8.1(A1) D10.1(A1) D12.1(A1) D14.1(A1) D25.1(A1) D26.1(A1) D27.1(A1) D28.1(A1) D30.1(A1) D31.1(A1) D32.1(A1) D33.1(A1) PL3.4 PL3.11 R25.1 R28.1 R35.1 R39.1 R151.1 R155.1 R159.1 R163.1 R171.1 R175.1 R179.1 R183.1 U5.3(-OUT:/LOCK) U5.4(-PWR:GND) U5.5(-PWR2:GND) U6.3(-OUT:/LOCK) U6.4(-PWR:GND) U6.5(-PWR2:GND) U9.3(-OUT:/LOCK) U9.4(-PWR:GND) U9.5(-PWR2:GND) U12.3(-OUT:/LOCK) U12.4(-PWR:GND) U12.5(-PWR2:GND) U19.3(-OUT:/LOCK) U19.4(-PWR:GND) U19.5(-PWR2:GND) U21.3(-OUT:/LOCK) U21.4(-PWR:GND) U21.5(-PWR2:GND) U22.3(-OUT:/LOCK) U22.4(-PWR:GND) U22.5(-PWR2:GND) U24.3(-OUT:/LOCK) U24.4(-PWR:GND) U24.5(-PWR2:GND) U25.3(-OUT:/LOCK) U25.4(-PWR:GND) U25.5(-PWR2:GND) U27.3(-OUT:/LOCK) U27.4(-PWR:GND) U27.5(-PWR2:GND) U28.3(-OUT:/LOCK) U28.4(-PWR:GND) U28.5(-PWR2:GND) U31.3(-OUT:/LOCK) U31.4(-PWR:GND) U31.5(-PWR2:GND) ; also sheet 1,2,3,4,6,7
N$10: U5.7(-OUT:OUT+) U11.7(-P1:O2) U11.10(-P1:O2)
N$11: U6.7(-OUT:OUT+) U10.7(-P1:O2) U10.10(-P1:O2)
N$12: R24.2 R25.2 U5.2(-OUT:-IN)
N$14: D8.3(C1A2) R168.1 U5.6(-OUT:OUT-) U11.8(-P1:O1) U11.9(-P1:O1)
N$15: R27.2 R28.2 U6.2(-OUT:-IN)
N$17: R41.1 U10.4(-P2:K)
N$18: R33.1 U10.2(-P1:K)
N$22: R34.2 R35.2 U9.2(-OUT:-IN)
N$26: R37.1 U11.4(-P2:K)
N$27: U10.5(-P2:O2) U10.12(-P2:O2) U12.7(-OUT:OUT+)
N$28: R38.2 R39.2 U12.2(-OUT:-IN)
N$31: D14.3(C1A2) R166.1 U10.6(-P2:O1) U10.11(-P2:O1) U12.6(-OUT:OUT-)
N$53: R75.1 U11.2(-P1:K)
N$56: R59.2 R180.1
N$63: R60.2 R184.1
N$68: D33.3(C1A2) R60.1 U29.6(-P2:O1) U29.11(-P2:O1) U31.6(-OUT:OUT-)
N$69: D10.3(C1A2) R167.1 U6.6(-OUT:OUT-) U10.8(-P1:O1) U10.9(-P1:O1)
N$71: R61.2 R176.1
N$84: R62.2 R160.1
N$117: R105.2 R172.1
N$118: U19.7(-OUT:OUT+) U20.7(-P1:O2) U20.10(-P1:O2)
N$119: R150.2 R151.2 U19.2(-OUT:-IN)
N$120: D25.3(C1A2) R127.1 U19.6(-OUT:OUT-) U20.8(-P1:O1) U20.9(-P1:O1)
N$121: U20.5(-P2:O2) U20.12(-P2:O2) U21.7(-OUT:OUT+)
N$122: R154.2 R155.2 U21.2(-OUT:-IN)
N$123: U22.7(-OUT:OUT+) U23.7(-P1:O2) U23.10(-P1:O2)
N$124: R158.2 R159.2 U22.2(-OUT:-IN)
N$125: D27.3(C1A2) R62.1 U22.6(-OUT:OUT-) U23.8(-P1:O1) U23.9(-P1:O1)
N$126: U24.7(-OUT:OUT+) U26.7(-P1:O2) U26.10(-P1:O2)
N$127: R162.2 R163.2 U24.2(-OUT:-IN)
N$128: R153.1 U20.2(-P1:K)
N$129: R161.1 U23.2(-P1:K)
N$130: R126.2 R156.1
N$131: R148.2 R164.1
N$132: R127.2 R152.1
N$133: R36.1 R149.2
N$134: R157.1 U20.4(-P2:K)
N$135: D26.3(C1A2) R126.1 U20.6(-P2:O1) U20.11(-P2:O1) U21.6(-OUT:OUT-)
N$136: R165.1 U26.2(-P1:K)
N$137: D28.3(C1A2) R148.1 U24.6(-OUT:OUT-) U26.8(-P1:O1) U26.9(-P1:O1)
N$138: U25.7(-OUT:OUT+) U26.5(-P2:O2) U26.12(-P2:O2)
N$139: R170.2 R171.2 U25.2(-OUT:-IN)
N$140: D30.3(C1A2) R105.1 U25.6(-OUT:OUT-) U26.6(-P2:O1) U26.11(-P2:O1)
N$141: U27.7(-OUT:OUT+) U29.7(-P1:O2) U29.10(-P1:O2)
N$142: R174.2 R175.2 U27.2(-OUT:-IN)
N$143: U23.5(-P2:O2) U23.12(-P2:O2) U28.7(-OUT:OUT+)
N$144: R178.2 R179.2 U28.2(-OUT:-IN)
N$145: D32.3(C1A2) R59.1 U23.6(-P2:O1) U23.11(-P2:O1) U28.6(-OUT:OUT-)
N$146: U29.5(-P2:O2) U29.12(-P2:O2) U31.7(-OUT:OUT+)
N$147: R182.2 R183.2 U31.2(-OUT:-IN)
N$148: R173.1 U26.4(-P2:K)
N$149: R181.1 U23.4(-P2:K)
N$150: R40.1 R166.2
N$153: R26.1 R168.2
N$154: R177.1 U29.2(-P1:K)
N$155: D31.3(C1A2) R61.1 U27.6(-OUT:OUT-) U29.8(-P1:O1) U29.9(-P1:O1)
N$156: R185.1 U29.4(-P2:K)
N$157: R29.1 R167.2
N$200: U9.7(-OUT:OUT+) U11.5(-P2:O2) U11.12(-P2:O2)
N$201: D12.3(C1A2) R149.1 U9.6(-OUT:OUT-) U11.6(-P2:O1) U11.11(-P2:O1)
PWM1_OUT: PL3.1 R26.2
PWM1_SELECT: R75.2 ; also sheet 7
PWM2_OUT: PL3.8 R36.2
PWM2_SELECT: R37.2 ; also sheet 7
PWM3_OUT: PL3.2 R29.2
PWM3_SELECT: R33.2 ; also sheet 7
PWM4_OUT: PL3.9 R40.2
PWM4_SELECT: R41.2 ; also sheet 7
PWM5_OUT: PL3.5 R152.2
PWM5_SELECT: R153.2 ; also sheet 7
PWM8_OUT: PL3.7 R160.2
PWM8_SELECT: R161.2 ; also sheet 7
PWM9_OUT: PL3.12 R156.2
PWM9_SELECT: R157.2 ; also sheet 7
PWM10_OUT: PL3.3 R164.2
PWM10_SELECT: R165.2 ; also sheet 7
PWM11_OUT: PL3.10 R172.2
PWM11_SELECT: R173.2 ; also sheet 7
PWM12_OUT: PL3.14 R180.2
PWM12_SELECT: R181.2 ; also sheet 7
PWM13_OUT: PL3.6 R176.2
PWM13_SELECT: R177.2 ; also sheet 7
PWM14_OUT: PL3.13 R184.2
PWM14_SELECT: R185.2 ; also sheet 7
TIM1_CH1: R24.1 ; also sheet 1
TIM2_CH1: R34.1 ; also sheet 1
TIM3_CH1: R27.1 ; also sheet 1
TIM4_CH1: R38.1 ; also sheet 1
TIM5_CH1: R150.1 ; also sheet 1
TIM8_CH2N: R158.1 ; also sheet 1
TIM9_CH1: R154.1 ; also sheet 1
TIM10_CH1: R162.1 ; also sheet 1
TIM11_CH1: R170.1 ; also sheet 1
TIM12_CH1: R178.1 ; also sheet 1
TIM13_CH1: R174.1 ; also sheet 1
TIM14_CH1: R182.1 ; also sheet 1
TRANSIL: D7.C D8.2(C2) D10.2(C2) D12.2(C2) D14.2(C2) D25.2(C2) D26.2(C2) D27.2(C2) D28.2(C2) D30.2(C2) D31.2(C2) D32.2(C2) D33.2(C2)
V_VARIABLE: C11.1 C14.1 C25.1 C26.2 C28.1 C32.1 C34.1 C35.1 C36.2 C37.2 C38.1 C39.2 C40.1 C42.1 C43.1 C45.1 C46.1 C51.1 C52.1 C53.1 C54.1 C55.1 C56.1 C57.1 U5.1(-PWR:VCC) U5.8(-PWR2:VCC) U6.1(-PWR:VCC) U6.8(-PWR2:VCC) U9.1(-PWR:VCC) U9.8(-PWR2:VCC) U12.1(-PWR:VCC) U12.8(-PWR2:VCC) U19.1(-PWR:VCC) U19.8(-PWR2:VCC) U21.1(-PWR:VCC) U21.8(-PWR2:VCC) U22.1(-PWR:VCC) U22.8(-PWR2:VCC) U24.1(-PWR:VCC) U24.8(-PWR2:VCC) U25.1(-PWR:VCC) U25.8(-PWR2:VCC) U27.1(-PWR:VCC) U27.8(-PWR2:VCC) U28.1(-PWR:VCC) U28.8(-PWR2:VCC) U31.1(-PWR:VCC) U31.8(-PWR2:VCC) ; also sheet 6

## Sheet 6 of 7
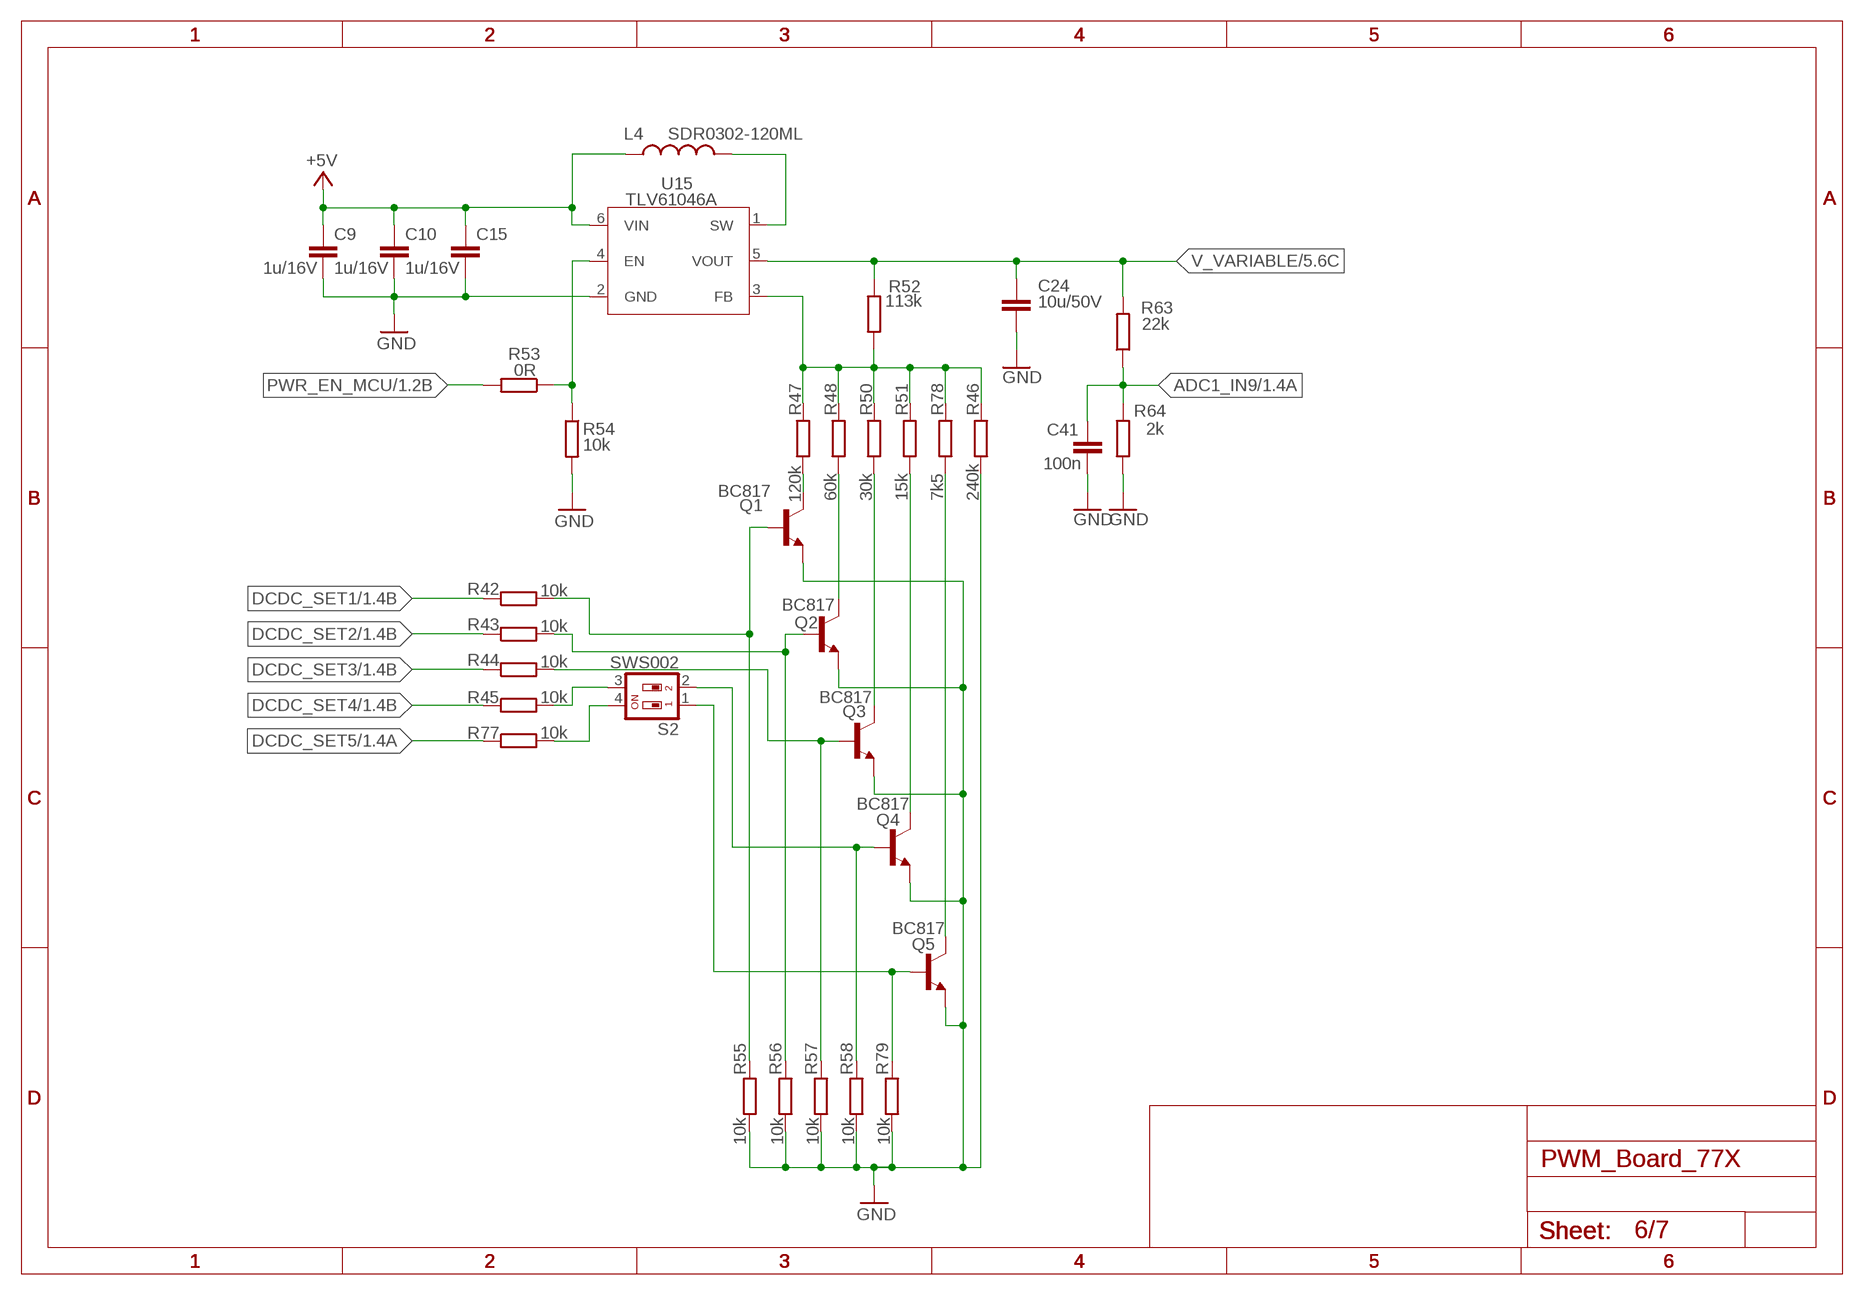
[diagram p6: schematic, sheet 6]

### Parts
C9  1u/16V  C-EUC0805  [C0805]
C10  1u/16V  C-EUC0805  [C0805]
C15  1u/16V  C-EUC0805  [C0805]
C24  10u/50V  C-EUC1206  [C1206]
C41  100n  C-EUC0805  [C0805]
L4  SDR0302-120ML  L-US  [IND_NPI43C]
Q1  BC817  BC817-25SMD  [SOT23-BEC]
Q2  BC817  BC817-25SMD  [SOT23-BEC]
Q3  BC817  BC817-25SMD  [SOT23-BEC]
Q4  BC817  BC817-25SMD  [SOT23-BEC]
Q5  BC817  BC817-25SMD  [SOT23-BEC]
R42  10k  R-EU_R0603  [R0603]
R43  10k  R-EU_R0603  [R0603]
R44  10k  R-EU_R0603  [R0603]
R45  10k  R-EU_R0603  [R0603]
R46  240k  R-EU_R0603  [R0603]
R47  120k  R-EU_R0603  [R0603]
R48  60k  R-EU_R0603  [R0603]
R50  30k  R-EU_R0603  [R0603]
R51  15k  R-EU_R0603  [R0603]
R52  113k  R-EU_R0603  [R0603]
R53  0R  R-EU_R0603  [R0603]
R54  10k  R-EU_R0603  [R0603]
R55  10k  R-EU_R0603  [R0603]
R56  10k  R-EU_R0603  [R0603]
R57  10k  R-EU_R0603  [R0603]
R58  10k  R-EU_R0603  [R0603]
R63  22k  R-EU_R0603  [R0603]
R64  2k  R-EU_R0603  [R0603]
R77  10k  R-EU_R0603  [R0603]
R78  7k5  R-EU_R0603  [R0603]
R79  10k  R-EU_R0603  [R0603]
S2  SWS002  [SMS-002]
U15  TLV61046A  [SOT23-6]

### Nets
+5V: C9.1 C10.1 C15.1 L4.1 U15.6(VIN) ; also sheet 3,4,5,7
ADC1_IN9: C41.1 R63.1 R64.2 ; also sheet 1
DCDC_SET1: R42.1 ; also sheet 1
DCDC_SET2: R43.1 ; also sheet 1
DCDC_SET3: R44.1 ; also sheet 1
DCDC_SET4: R45.1 ; also sheet 1
DCDC_SET5: R77.1 ; also sheet 1
GND: C9.2 C10.2 C15.2 C24.2 C41.2 Q1.E Q2.E Q3.E Q4.E Q5.E R46.1 R54.2 R55.2 R56.2 R57.2 R58.2 R64.1 R79.2 U15.2(GND) ; also sheet 1,2,3,4,5,7
N$13: R77.2 S2.4
N$33: R46.2 R47.2 R48.2 R50.2 R51.2 R52.1 R78.2 U15.3(FB)
N$39: Q2.C R48.1
N$40: Q3.C R50.1
N$41: Q4.C R51.1
N$42: Q1.C R47.1
N$43: Q2.B R43.2 R56.1
N$45: Q4.B R58.1 S2.2
N$46: R45.2 S2.3
N$47: Q3.B R44.2 R57.1
N$49: Q1.B R42.2 R55.1
N$50: R53.1 R54.1 U15.4(EN)
N$54: L4.2 U15.1(SW)
N$65: Q5.C R78.1
N$66: Q5.B R79.1 S2.1
PWR_EN_MCU: R53.2 ; also sheet 1
V_VARIABLE: C24.1 R52.2 R63.2 U15.5(VOUT) ; also sheet 5

## Sheet 7 of 7
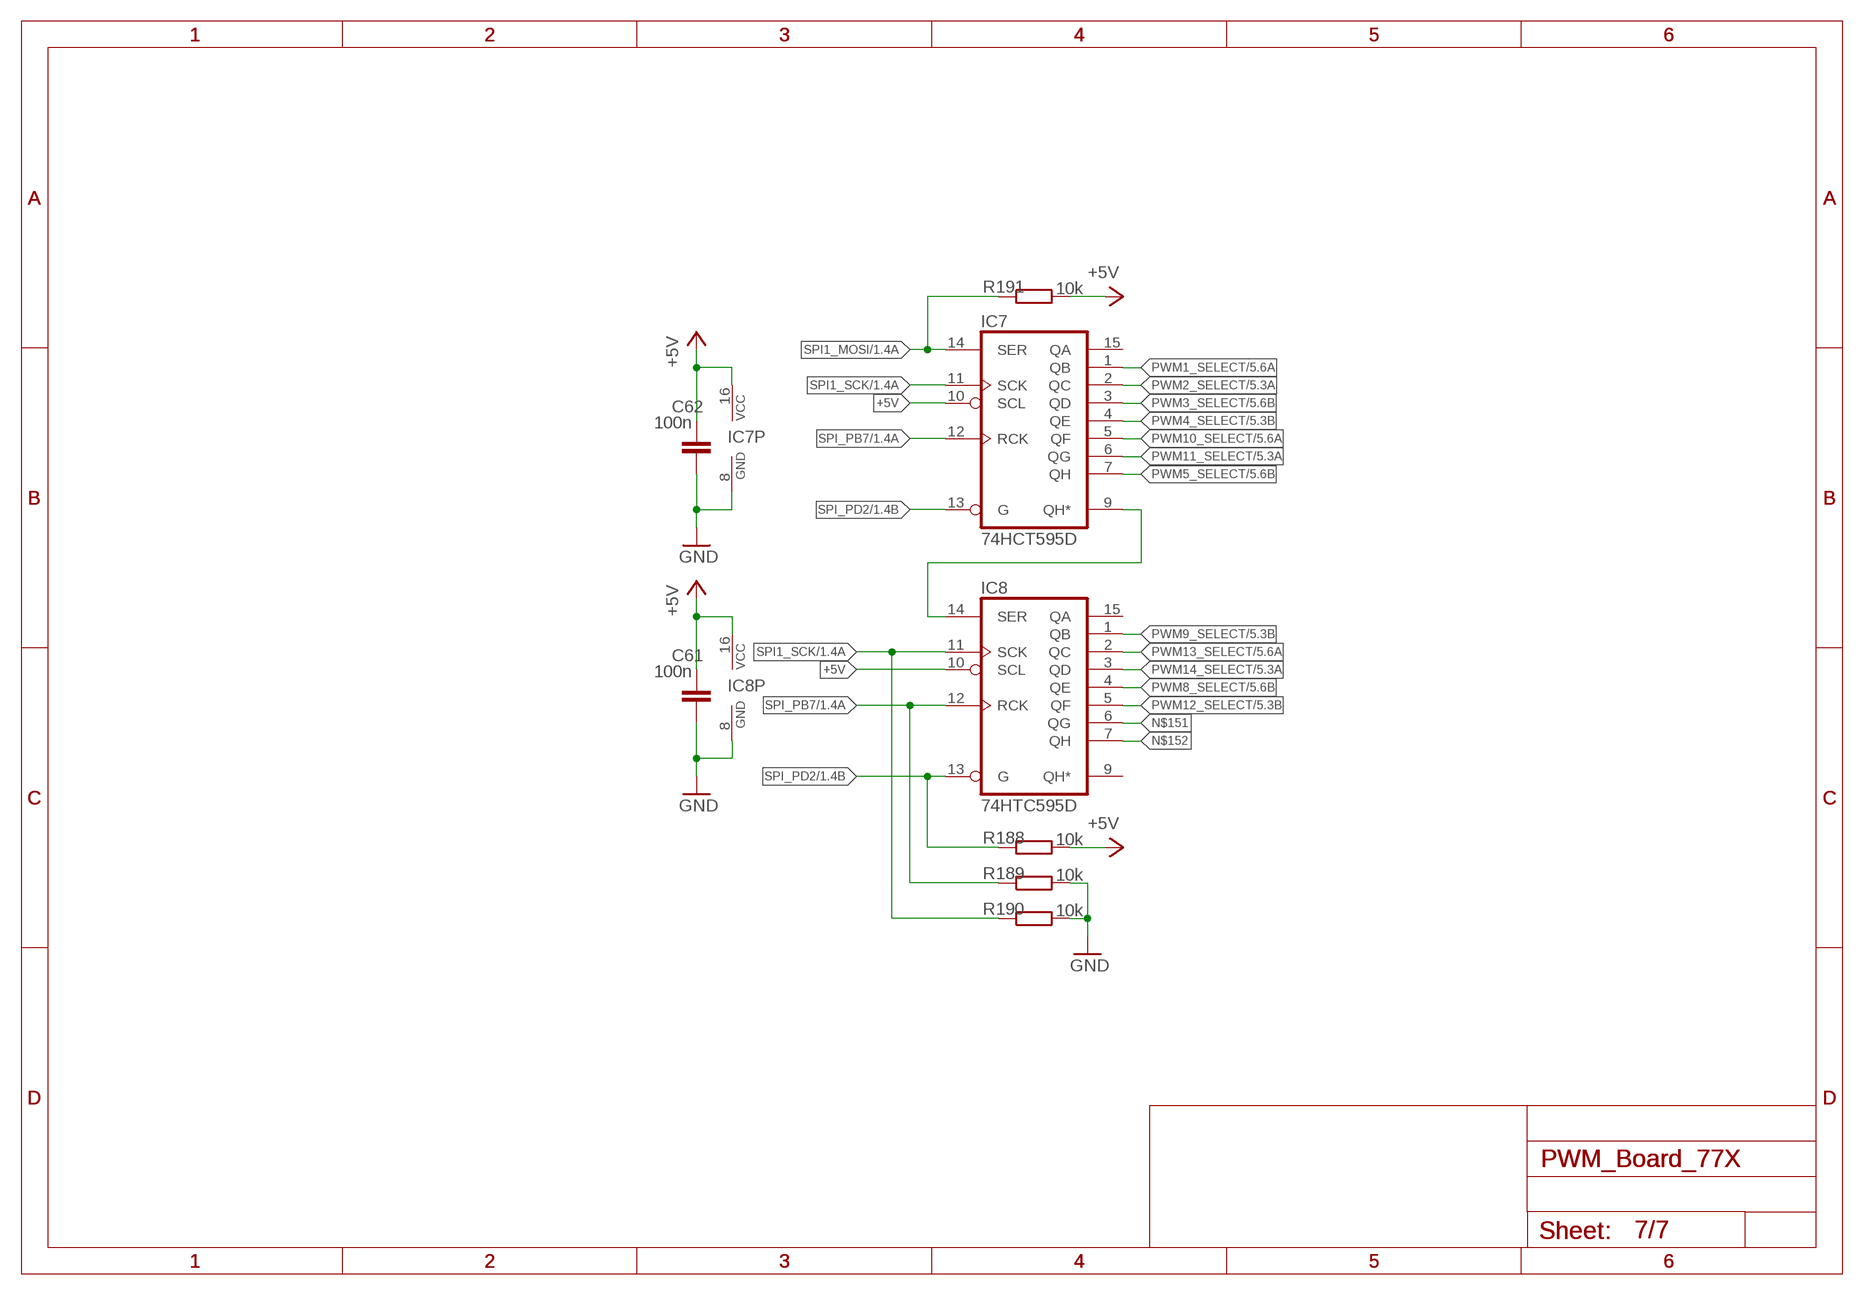
[diagram p7: schematic, sheet 7]

### Parts
C61  100n  C-EUC0805  [C0805]
C62  100n  C-EUC0805  [C0805]
IC7  74HCT595D  74HC595D  [SO16]
IC8  74HTC595D  74HC595D  [SO16]
R188  10k  R-EU_R0603  [R0603]
R189  10k  R-EU_R0603  [R0603]
R190  10k  R-EU_R0603  [R0603]
R191  10k  R-EU_R0603  [R0603]

### Nets
+5V: C61.1 C62.1 IC7.10(SCL) IC7.16(VCC) IC8.10(SCL) IC8.16(VCC) R188.2 R191.2 ; also sheet 3,4,5,6
GND: C61.2 C62.2 IC7.8(GND) IC8.8(GND) R189.2 R190.2 ; also sheet 1,2,3,4,5,6
N$55: IC7.9(QH*) IC8.14(SER)
N$151: IC8.6(QG)
N$152: IC8.7(QH)
PWM1_SELECT: IC7.1(QB) ; also sheet 5
PWM2_SELECT: IC7.2(QC) ; also sheet 5
PWM3_SELECT: IC7.3(QD) ; also sheet 5
PWM4_SELECT: IC7.4(QE) ; also sheet 5
PWM5_SELECT: IC7.7(QH) ; also sheet 5
PWM8_SELECT: IC8.4(QE) ; also sheet 5
PWM9_SELECT: IC8.1(QB) ; also sheet 5
PWM10_SELECT: IC7.5(QF) ; also sheet 5
PWM11_SELECT: IC7.6(QG) ; also sheet 5
PWM12_SELECT: IC8.5(QF) ; also sheet 5
PWM13_SELECT: IC8.2(QC) ; also sheet 5
PWM14_SELECT: IC8.3(QD) ; also sheet 5
SPI1_MOSI: IC7.14(SER) R191.1 ; also sheet 1
SPI1_SCK: IC7.11(SCK) IC8.11(SCK) R190.1 ; also sheet 1
SPI_PB7: IC7.12(RCK) IC8.12(RCK) R189.1 ; also sheet 1
SPI_PD2: IC7.13(G) IC8.13(G) R188.1 ; also sheet 1
Unconnected: IC7.15(QA) IC8.9(QH*) IC8.15(QA)

## Library data of the parts
C1 C3 C5 C7 C11-C14 C16 C17 C20 C23 C25 C26 C28 C32-C40 C42 C43 C45 C46 C51-C57 C59-C62 C68 = rcl:C-EU: CAPACITOR, European symbol; SPICEPREFIX: C
C2 C9 C10 C15 C24 C31 C41 C48-C50 C58 C65-C67 C69 = rcl@1:C-EU: CAPACITOR, European symbol; SPICEPREFIX: C
C8 C27 = rcl@1:CPOL-EU: POLARIZED CAPACITOR, European symbol; SPICEPREFIX: C
C18 C19 = Relay_Board_REVB:C-EU: CAPACITOR, European symbol; SPICEPREFIX: C
C21 C22 = rcl:CPOL-EU: POLARIZED CAPACITOR, European symbol; SPICEPREFIX: C
C44 C47 C63 C64 = NTC_Board:C-EU: CAPACITOR, European symbol; SPICEPREFIX: C
D1 = NTC_Board_REVB:SM712-02HTG; OC_FARNELL: 2749175
D2 = NTC_Board_REVB:SMBJ26A; OC_FARNELL: 1827615
D3-D6 D9 D11 D13 D15-D23 = diode:BAV199: DIODE low-leakage double diode
D7 = diode:SUPPRESSOR-: Suppressor diode
D8 D10 D12 D14 D25-D28 D30-D33 = diode:BAS70-04: Silicon Schottky Diodes General-purpose diode for high-speed switching
GND = Analog_Board:MA03-1: PIN HEADER; OC_FARNELL: unknown; OC_NEWARK: unknown
IC1 = analog-devices:AD8599: Single and Dual, Ultralow Distortion, Ultralow Noise Op Amps Source: http://www.analog.com/static/imported-files/data_sheets/AD8597_8599.pdf; MPN: AD8599ARZ; OC_FARNELL: 1438872; OC_NEWARK: 34M5072
IC2 = Relay_Board_REVB:LM1117
IC3-IC6 = linear:TLC339: COMPARATOR
IC7 IC8 = 74xx-eu:74*595: 8-bit SHIFT REGISTER, output latch
K1 = NTC_Board:CORTEX_DEBUG: Cortex Debug Connector - 10 pin Supports JTAG debug, Serial Wire debug, and Serial Wire Viewer. PTH and SMD connector options available. General Connector Information <http://infocenter.arm.com/help/topic/com.arm.doc.faqs/attached/13634/cortex_debug_connectors.pdf> Products: PTH Connector <http://www.digikey.com/product-detail/en/cnc-tech/3220-10-0100-00/1175-1627-ND/3883661> -via Digi-Key SparkFun PSoc <https://www.sparkfun.com/products/13229> SparkFun T <https://www.sparkfun.com/products/13810>; OC_FARNELL: 1667729
K2 = NTC_Board_REVB:VG64: PCB EUROCARD, 64-pin type C/AC, 2.54 mm Typically use package VG64P.; OC_FARNELL: 1096949
L1 L2 = NTC_Board:L-US: INDUCTOR, American symbol; OC_FARNELL: 2470292; SPICEPREFIX: L
L4 = rcl2:L-US: INDUCTOR, American symbol
L5 = Input_board:L-US*?:1: INDUCTOR, American symbol; OC_FARNELL: 2286872; SPICEPREFIX: L
LED5 LED6 = NTC_Board:LED: LED OSRAM: - CHIPLED LG R971, LG N971, LY N971, LG Q971, LY Q971, LO R971, LY R971 LH N974, LH R974 LS Q976, LO Q976, LY Q976 LO Q996 - Hyper CHIPLED LW Q18S LB Q993, LB Q99A, LB R99A - SideLED LS A670, LO A670, LY A670, LG A670, LP A670 LB A673, LV A673, LT A673, LW A673 LH A674 LY A675 LS A676, LA A676, LO A676, LY A676, LW A676 LS A679, LY A679, LG A679 - Hyper Micro SIDELED® LS Y876, LA Y876, LO Y876, LY Y876 LT Y87S - SmartLED LW L88C, LW L88S LB L89C, LB L89S, LG L890 LS L89K, LO L89K, LY L89K LS L896, LA L896, LO L896, LY L896 - TOPLED LS T670, LO T670, LY T670, LG T670, LP T670 LSG T670, LSP T670, LSY T670, LOP T670, LYG T670 LG T671, LOG T671, LSG T671 LB T673, LV T673, LT T673, LW T673 LH T674 LS T676, LA T676, LO T676, LY T676, LB T676, LH T676, LSB T676, LW T676 LB T67C, LV T67C, LT T67C, LS T67K, LO T67K, LY T67K, LW E67C LS E67B, LA E67B, LO E67B, LY E67B, LB E67C, LV E67C, LT E67C LW T67C LS T679, LY T679, LG T679 LS T770, LO T770, LY T770, LG T770, LP T770 LB T773, LV T773, LT T773, LW T773 LH T774 LS E675, LA E675, LY E675, LS T675 LS T776, LA T776, LO T776, LY T776, LB T776 LHGB T686 LT T68C, LB T68C - Hyper Mini TOPLED® LB M676 - Mini TOPLED Santana® LG M470 LS M47K, LO M47K, LY M47K Source: http://www.osram.convergy.de LUXEON: - LUMILED® LXK2-PW12-R00, LXK2-PW12-S00, LXK2-PW14-U00, LXK2-PW14-V00 LXK2-PM12-R00, LXK2-PM12-S00, LXK2-PM14-U00 LXK2-PE12-Q00, LXK2-PE12-R00, LXK2-PE12-S00, LXK2-PE14-T00, LXK2-PE14-U00 LXK2-PB12-K00, LXK2-PB12-L00, LXK2-PB12-M00, LXK2-PB14-N00, LXK2-PB14-P00, LXK2-PB14-Q00 LXK2-PR12-L00, LXK2-PR12-M00, LXK2-PR14-Q00, LXK2-PR14-R00 LXK2-PD12-Q00, LXK2-PD12-R00, LXK2-PD12-S00 LXK2-PH12-R00, LXK2-PH12-S00 LXK2-PL12-P00, LXK2-PL12-Q00, LXK2-PL12-R00 Source: www.luxeon.com KINGBRIGHT: KA-3528ASYC Source: www.kingbright.com
OSC = NTC_Board_REVB:Q22FA12800249; OC_FARNELL: 2723223
PL1 = con-molex-2:555X-18: Mini FIT connector 18 way
PL3 = con-molex-2:555X-14: Mini FIT connector 14 way
Q1-Q5 = transistor-npn:BC817*: NPN Transistor
R1 R3-R5 R7-R9 R11 R12 R15-R19 R21-R24 R27 R30-R34 R37 R38 R41 R49 R53 R63 R66-R76 R80-R87 R89-R91 R93-R95 R97-R104 R107-R109 R111-R113 R115-R117 R119-R125 R129-R131 R133-R135 R137-R139 R141-R147 R150 R153 R154 R157 R158 R161 R162 R165 R169 R170 R173 R174 R177 R178 R181 R182 R185-R187 = rcl:R-EU_: RESISTOR, European symbol
R2 R6 R10 R20 R25 R28 R35 R39 R42-R48 R50-R52 R54-R58 R64 R65 R77-R79 R88 R92 R96 R106 R110 R114 R118 R128 R132 R136 R140 R151 R155 R159 R163 R171 R175 R179 R183 R188-R191 = rcl@1:R-EU_: RESISTOR, European symbol; SPICEPREFIX: R
R13 R14 = rcl:R-EU_: RESISTOR, European symbol; OC_FARNELL: 2887146
R26 R29 R36 R40 R59-R62 R105 R126 R127 R148 R149 R152 R156 R160 R164 R166-R168 R172 R176 R180 R184 = resistor:R-EU_: RESISTOR, European symbol
S1 = NTC_Board_REVB:SWS003: SMD Dip Switch 3 pol.; OC_FARNELL: 1524006
S2 = smd-special:SWS002: SMD Dip Switch 2 pol.
U1 = stm32f4:STM32F446RE_64PIN: STM32F446RE
U2 = NTC_Board_REVB:SH-7050TB; OC_FARNELL: 2854802
U5 U6 U9 U12 U19 U21 U22 U24 U25 U27 U28 U31 = PWM_Board:TC4432
U7 = NTC_Board_REVB:IU2405SA; OC_FARNELL: 1435422
U10 U11 U20 U23 U26 U29 = PWM_Board:TLP222A-2/TLP171D
U14 = Relay_board:R-78E-0.5; OC_FARNELL: 2078564
U15 = zetex:TLV61046A
U30 = texas:ISO3082; OC_FARNELL: 1755040